# EAGLE schematic isolator_v2 (EAGLE 5.12)

## Sheet 1 of 6
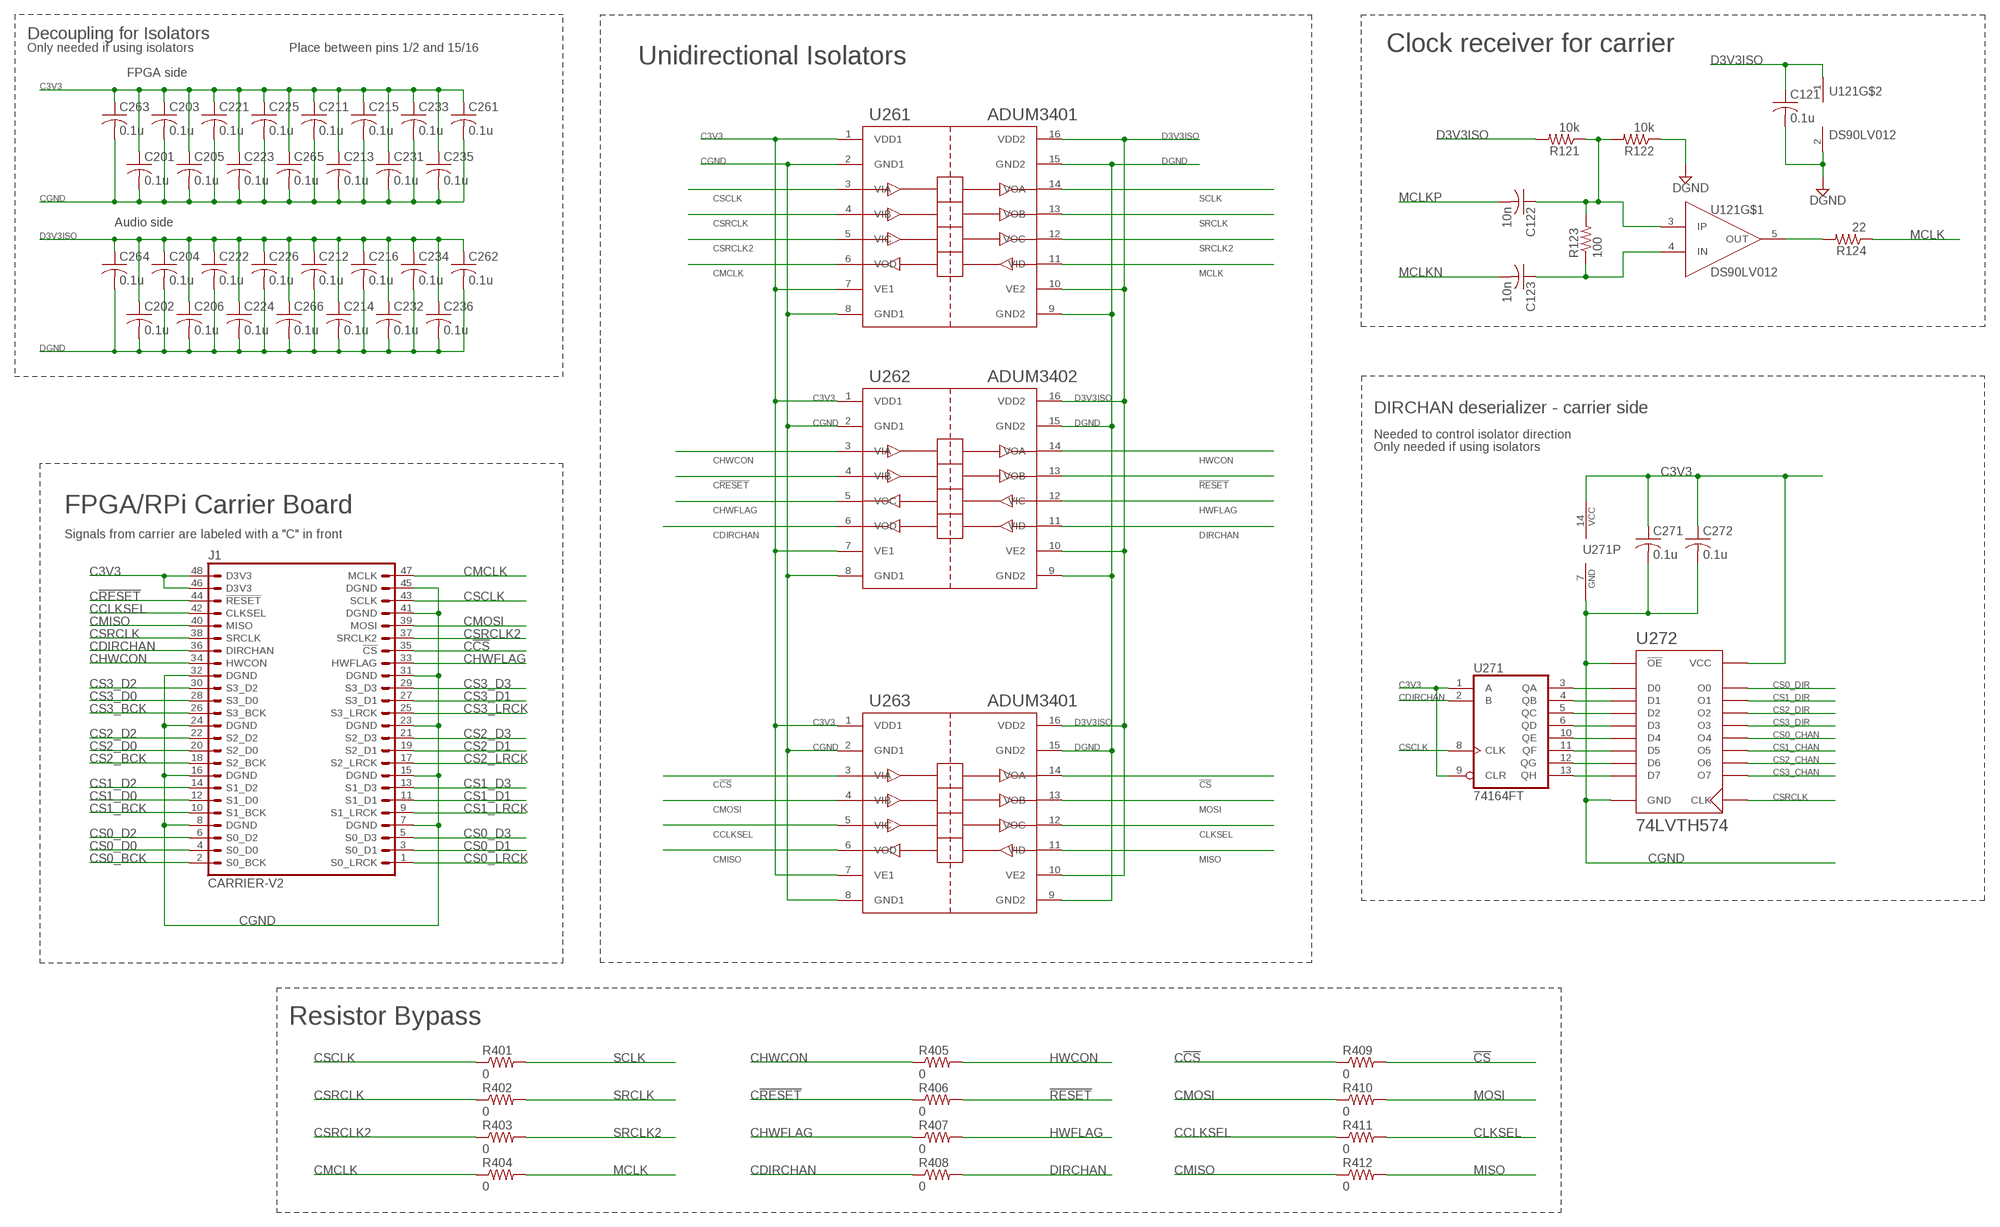
[diagram p0: schematic, sheet 1]

### Parts
C121  0.1u  C-USC0603  [C0603]
C122  10n  C-USC0603  [C0603]
C123  10n  C-USC0603  [C0603]
C201  0.1u  C-USC0603  [C0603]
C202  0.1u  C-USC0603  [C0603]
C203  0.1u  C-USC0603  [C0603]
C204  0.1u  C-USC0603  [C0603]
C205  0.1u  C-USC0603  [C0603]
C206  0.1u  C-USC0603  [C0603]
C211  0.1u  C-USC0603  [C0603]
C212  0.1u  C-USC0603  [C0603]
C213  0.1u  C-USC0603  [C0603]
C214  0.1u  C-USC0603  [C0603]
C215  0.1u  C-USC0603  [C0603]
C216  0.1u  C-USC0603  [C0603]
C221  0.1u  C-USC0603  [C0603]
C222  0.1u  C-USC0603  [C0603]
C223  0.1u  C-USC0603  [C0603]
C224  0.1u  C-USC0603  [C0603]
C225  0.1u  C-USC0603  [C0603]
C226  0.1u  C-USC0603  [C0603]
C231  0.1u  C-USC0603  [C0603]
C232  0.1u  C-USC0603  [C0603]
C233  0.1u  C-USC0603  [C0603]
C234  0.1u  C-USC0603  [C0603]
C235  0.1u  C-USC0603  [C0603]
C236  0.1u  C-USC0603  [C0603]
C261  0.1u  C-USC0603  [C0603]
C262  0.1u  C-USC0603  [C0603]
C263  0.1u  C-USC0603  [C0603]
C264  0.1u  C-USC0603  [C0603]
C265  0.1u  C-USC0603  [C0603]
C266  0.1u  C-USC0603  [C0603]
C271  0.1u  C-USC0603  [C0603]
C272  0.1u  C-USC0603  [C0603]
J1  CARRIER-V2  [MA24-2]
R121  10k  R-US_R0603  [R0603]
R122  10k  R-US_R0603  [R0603]
R123  100  R-US_R0603  [R0603]
R124  22  R-US_R0603  [R0603]
R401  0  R-US_R1206  [R1206]
R402  0  R-US_R1206  [R1206]
R403  0  R-US_R1206  [R1206]
R404  0  R-US_R1206  [R1206]
R405  0  R-US_R1206  [R1206]
R406  0  R-US_R1206  [R1206]
R407  0  R-US_R1206  [R1206]
R408  0  R-US_R1206  [R1206]
R409  0  R-US_R1206  [R1206]
R410  0  R-US_R1206  [R1206]
R411  0  R-US_R1206  [R1206]
R412  0  R-US_R1206  [R1206]
U121  DS90LV012  [SOT23-DBV]
U261  ADUM3401  [SO-16W]
U262  ADUM3402  [SO-16W]
U263  ADUM3401  [SO-16W]
U271  74164FT  [TSSOP14]
U272  74LVTH574  [TSSOP20]

### Nets
!CS: R409.2 U263.14(VOA) ; also sheet 6
!RESET: R406.2 U262.13(VOB) ; also sheet 5
C3V3 [power]: C201.1 C203.1 C205.1 C211.1 C213.1 C215.1 C221.1 C223.1 C225.1 C231.1 C233.1 C235.1 C261.1 C263.1 C265.1 C271.1 C272.1 J1.46(D3V3) J1.48(D3V3) U261.1(VDD1) U261.7(VE1) U262.1(VDD1) U262.7(VE1) U263.1(VDD1) U263.7(VE1) U271.1(A) U271.9(CLR) U271.14(VCC) U272.20(VCC) ; also sheet 2
C!CS: J1.35(!CS) R409.1 U263.3(VIA) ; also sheet 3
C!RESET: J1.44(!RESET) R406.1 U262.4(VIB) ; also sheet 3
CCLKSEL: J1.42(CLKSEL) R411.1 U263.5(VIC) ; also sheet 3
CDIRCHAN: J1.36(DIRCHAN) R408.1 U262.6(VOD) U271.2(B) ; also sheet 3
CGND [power]: C201.2 C203.2 C205.2 C211.2 C213.2 C215.2 C221.2 C223.2 C225.2 C231.2 C233.2 C235.2 C261.2 C263.2 C265.2 C271.2 C272.2 J1.7(DGND) J1.8(DGND) J1.15(DGND) J1.16(DGND) J1.23(DGND) J1.24(DGND) J1.31(DGND) J1.32(DGND) J1.41(DGND) J1.45(DGND) U261.2(GND1) U261.8(GND1) U262.2(GND1) U262.8(GND1) U263.2(GND1) U263.8(GND1) U271.7(GND) U272.1(!OE) U272.10(GND) ; also sheet 2,3
CHWCON: J1.34(HWCON) R405.1 U262.3(VIA) ; also sheet 3
CHWFLAG: J1.33(HWFLAG) R407.1 U262.5(VOC) ; also sheet 3
CLKSEL: R411.2 U263.12(VOC) ; also sheet 6
CMCLK: J1.47(MCLK) R404.1 U261.6(VOD) ; also sheet 3
CMISO: J1.40(MISO) R412.1 U263.6(VOD) ; also sheet 3
CMOSI: J1.39(MOSI) R410.1 U263.4(VIB) ; also sheet 3
CS0_BCK: J1.2(S0_BCK) ; also sheet 2,3
CS0_CHAN: U272.15(O4)
CS0_D0: J1.4(S0_D0) ; also sheet 2,3
CS0_D1: J1.3(S0_D1) ; also sheet 2,3
CS0_D2: J1.6(S0_D2) ; also sheet 2,3
CS0_D3: J1.5(S0_D3) ; also sheet 2,3
CS0_DIR: U272.19(O0) ; also sheet 2
CS0_LRCK: J1.1(S0_LRCK) ; also sheet 2,3
CS1_BCK: J1.10(S1_BCK) ; also sheet 2,3
CS1_CHAN: U272.14(O5)
CS1_D0: J1.12(S1_D0) ; also sheet 2,3
CS1_D1: J1.11(S1_D1) ; also sheet 2,3
CS1_D2: J1.14(S1_D2) ; also sheet 2,3
CS1_D3: J1.13(S1_D3) ; also sheet 2,3
CS1_DIR: U272.18(O1) ; also sheet 2
CS1_LRCK: J1.9(S1_LRCK) ; also sheet 2,3
CS2_BCK: J1.18(S2_BCK) ; also sheet 2,3
CS2_CHAN: U272.13(O6)
CS2_D0: J1.20(S2_D0) ; also sheet 2,3
CS2_D1: J1.19(S2_D1) ; also sheet 2,3
CS2_D2: J1.22(S2_D2) ; also sheet 2,3
CS2_D3: J1.21(S2_D3) ; also sheet 2,3
CS2_DIR: U272.17(O2) ; also sheet 2
CS2_LRCK: J1.17(S2_LRCK) ; also sheet 2,3
CS3_BCK: J1.26(S3_BCK) ; also sheet 2,3
CS3_CHAN: U272.12(O7)
CS3_D0: J1.28(S3_D0) ; also sheet 2,3
CS3_D1: J1.27(S3_D1) ; also sheet 2,3
CS3_D2: J1.30(S3_D2) ; also sheet 2,3
CS3_D3: J1.29(S3_D3) ; also sheet 2,3
CS3_DIR: U272.16(O3) ; also sheet 2
CS3_LRCK: J1.25(S3_LRCK) ; also sheet 2,3
CSCLK: J1.43(SCLK) R401.1 U261.3(VIA) U271.8(CLK) ; also sheet 3
CSRCLK: J1.38(SRCLK) R402.1 U261.4(VIB) U272.11(CLK) ; also sheet 3
CSRCLK2: J1.37(SRCLK2) R403.1 U261.5(VIC) ; also sheet 3
D3V3ISO [power]: C121.1 C202.1 C204.1 C206.1 C212.1 C214.1 C216.1 C222.1 C224.1 C226.1 C232.1 C234.1 C236.1 C262.1 C264.1 C266.1 R121.2 U121.1(V+) U261.10(VE2) U261.16(VDD2) U262.10(VE2) U262.16(VDD2) U263.10(VE2) U263.16(VDD2) ; also sheet 2,6
DGND [power]: C121.2 C202.2 C204.2 C206.2 C212.2 C214.2 C216.2 C222.2 C224.2 C226.2 C232.2 C234.2 C236.2 C262.2 C264.2 C266.2 R122.1 U121.2(V-) U261.9(GND2) U261.15(GND2) U262.9(GND2) U262.15(GND2) U263.9(GND2) U263.15(GND2) ; also sheet 2,3,4,5,6
DIRCHAN: R408.2 U262.11(VID) ; also sheet 6
HWCON: R405.2 U262.14(VOA) ; also sheet 6
HWFLAG: R407.2 U262.12(VIC) ; also sheet 6
MCLK: R124.1 R404.2 U261.11(VID)
MCLKN: C123.2 ; also sheet 6
MCLKP: C122.2 ; also sheet 6
MISO: R412.2 U263.11(VID) ; also sheet 5,6
MOSI: R410.2 U263.13(VOB) ; also sheet 5
N$21: U271.3(QA) U272.2(D0)
N$22: U271.4(QB) U272.3(D1)
N$23: U271.5(QC) U272.4(D2)
N$24: U271.6(QD) U272.5(D3)
N$25: U271.10(QE) U272.6(D4)
N$26: U271.11(QF) U272.7(D5)
N$27: U271.12(QG) U272.8(D6)
N$28: U271.13(QH) U272.9(D7)
N$30: C123.1 R123.1 U121.4(IN)
N$31: C122.1 R121.1 R122.2 R123.2 U121.3(IP)
N$32: R124.2 U121.5(OUT)
SCLK: R401.2 U261.14(VOA) ; also sheet 5,6
SRCLK: R402.2 U261.13(VOB) ; also sheet 5,6
SRCLK2: R403.2 U261.12(VOC) ; also sheet 5

### Notes on the sheet
- Decoupling for Isolators
- Only needed if using isolators | Place between pins 1/2 and 15/16 | Clock receiver for carrier
- Unidirectional Isolators
- FPGA side
- Audio side
- DIRCHAN deserializer - carrier side
- Needed to control isolator direction
- Only needed if using isolators
- FPGA/RPi Carrier Board
- Signals from carrier are labeled with a "C" in front
- Resistor Bypass

## Sheet 2 of 6
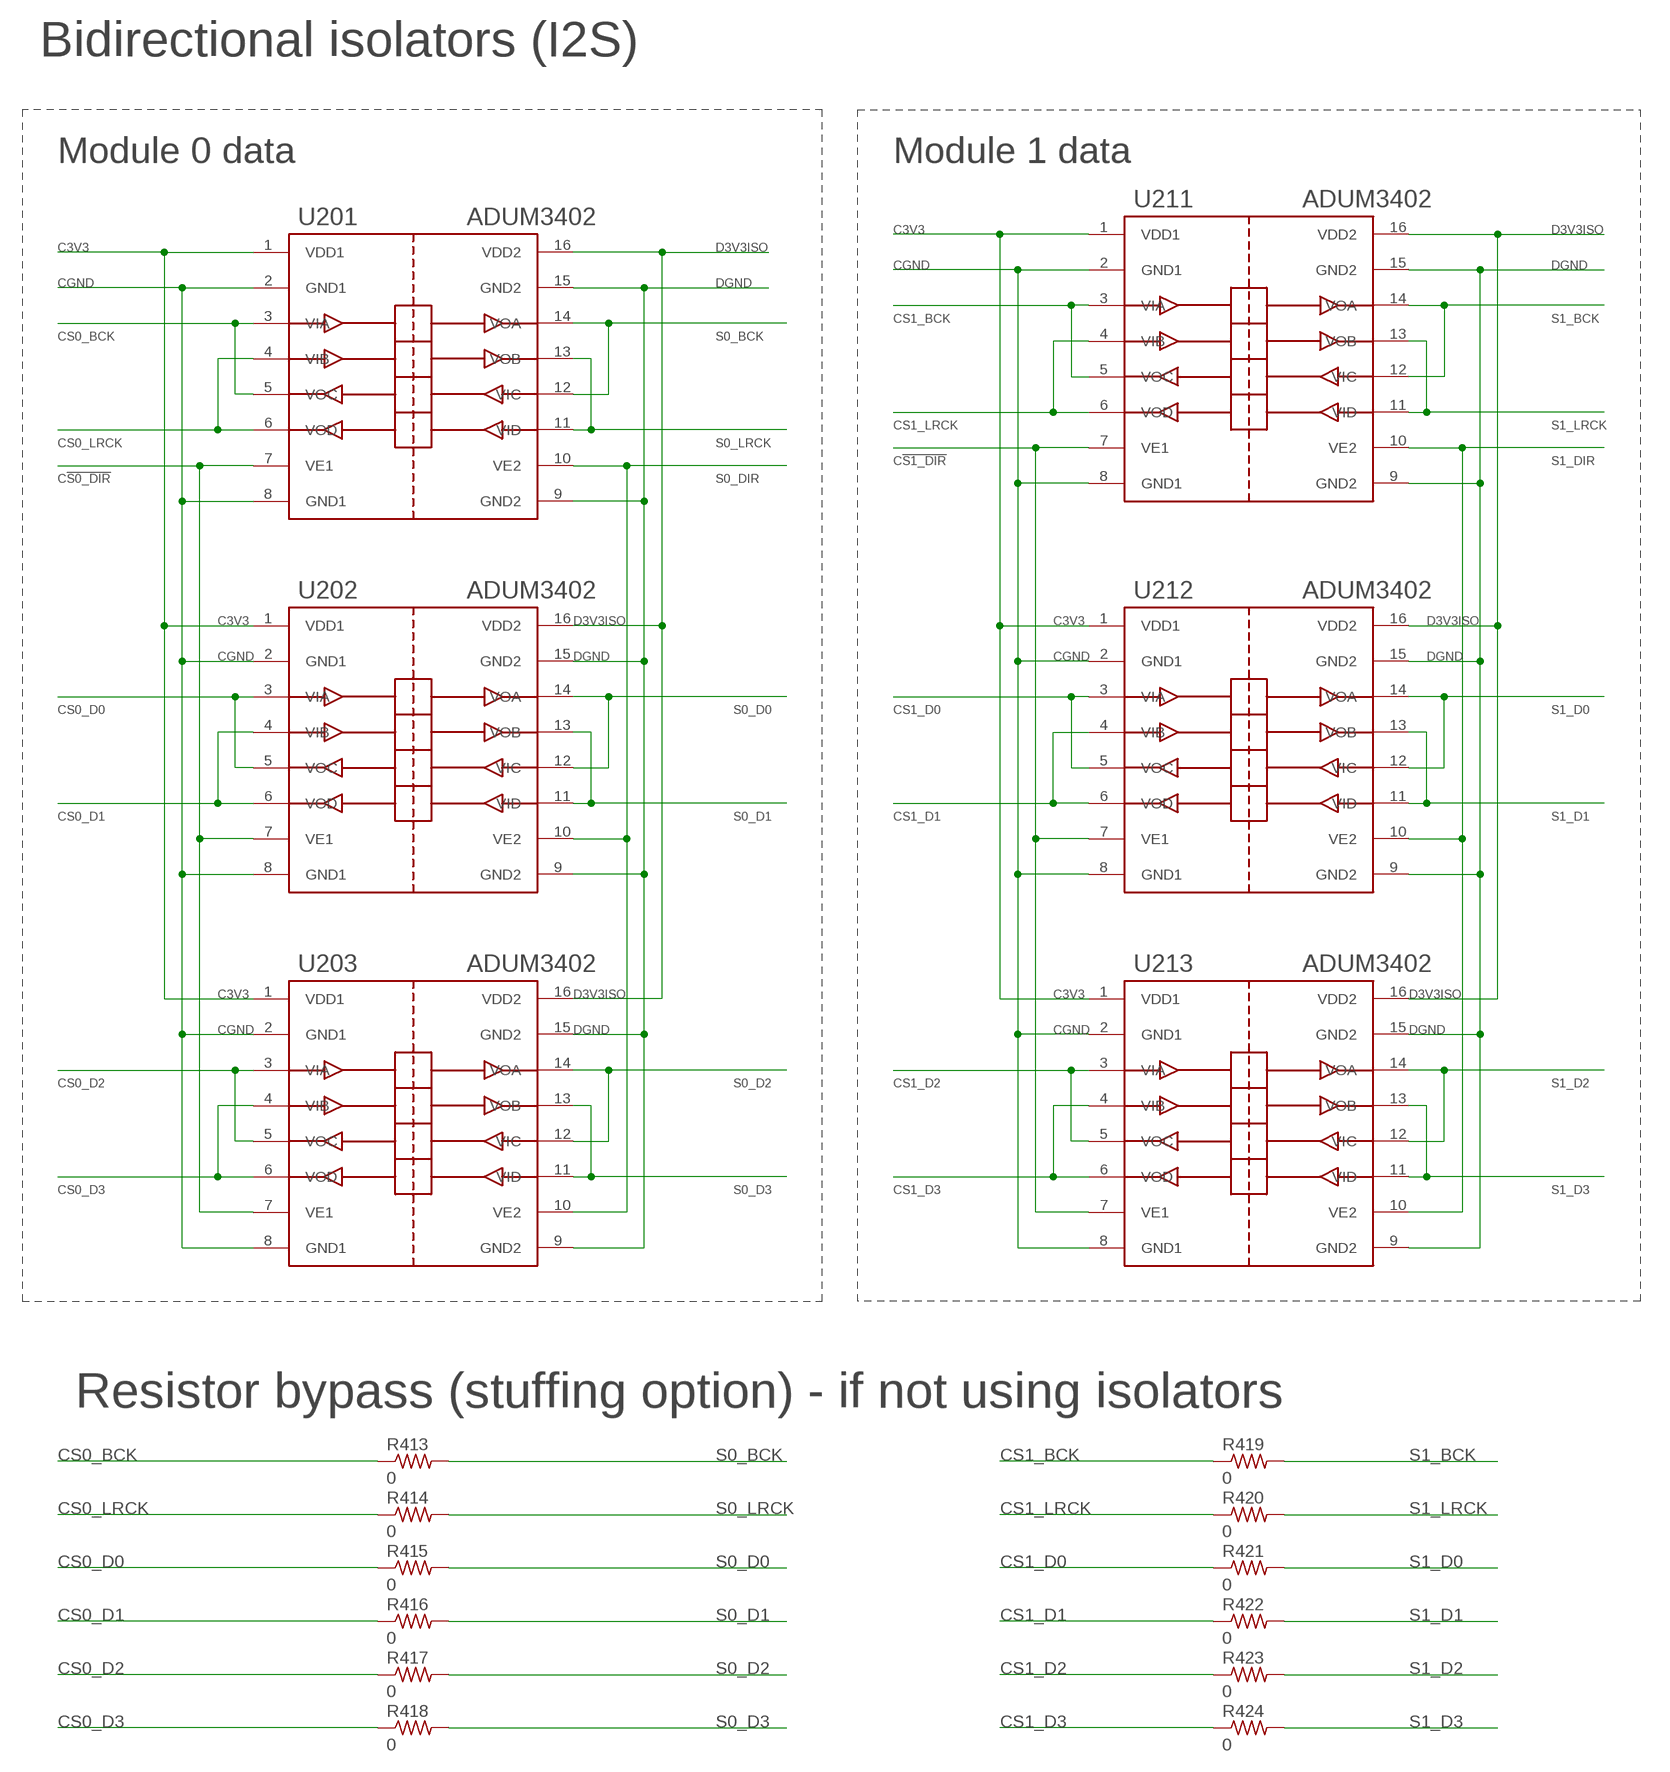
[diagram p1: schematic, sheet 2, part 1 of 2]
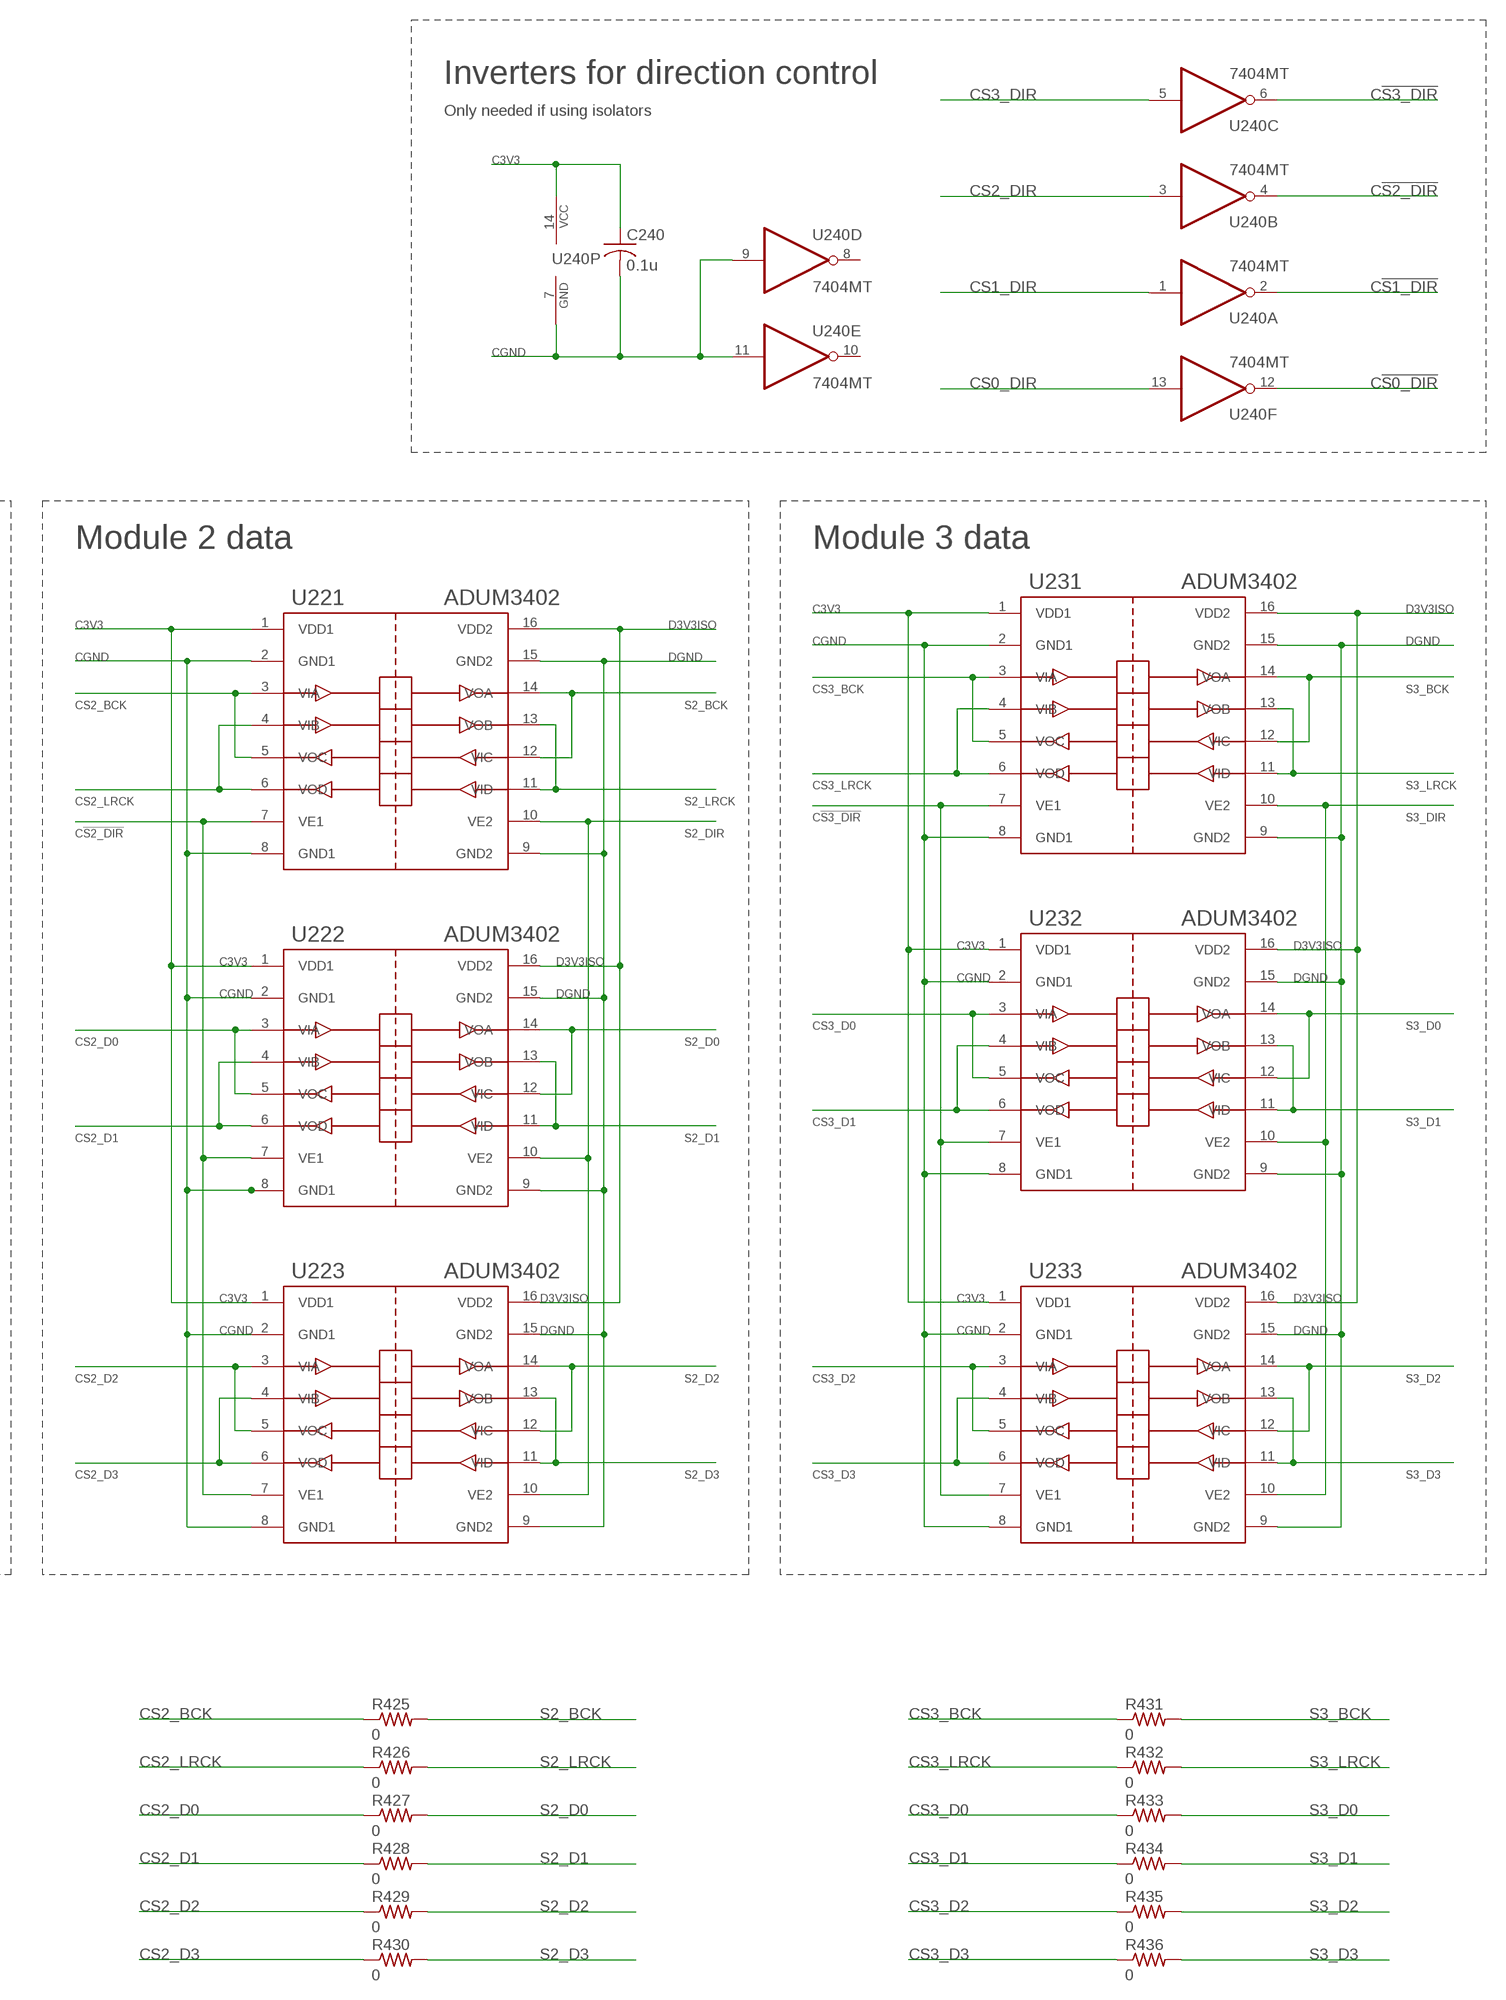
[diagram p2: schematic, sheet 2, part 2 of 2]

### Parts
C240  0.1u  C-USC0603  [C0603]
R413  0  R-US_R1206  [R1206]
R414  0  R-US_R1206  [R1206]
R415  0  R-US_R1206  [R1206]
R416  0  R-US_R1206  [R1206]
R417  0  R-US_R1206  [R1206]
R418  0  R-US_R1206  [R1206]
R419  0  R-US_R1206  [R1206]
R420  0  R-US_R1206  [R1206]
R421  0  R-US_R1206  [R1206]
R422  0  R-US_R1206  [R1206]
R423  0  R-US_R1206  [R1206]
R424  0  R-US_R1206  [R1206]
R425  0  R-US_R1206  [R1206]
R426  0  R-US_R1206  [R1206]
R427  0  R-US_R1206  [R1206]
R428  0  R-US_R1206  [R1206]
R429  0  R-US_R1206  [R1206]
R430  0  R-US_R1206  [R1206]
R431  0  R-US_R1206  [R1206]
R432  0  R-US_R1206  [R1206]
R433  0  R-US_R1206  [R1206]
R434  0  R-US_R1206  [R1206]
R435  0  R-US_R1206  [R1206]
R436  0  R-US_R1206  [R1206]
U201  ADUM3402  [SO-16W]
U202  ADUM3402  [SO-16W]
U203  ADUM3402  [SO-16W]
U211  ADUM3402  [SO-16W]
U212  ADUM3402  [SO-16W]
U213  ADUM3402  [SO-16W]
U221  ADUM3402  [SO-16W]
U222  ADUM3402  [SO-16W]
U223  ADUM3402  [SO-16W]
U231  ADUM3402  [SO-16W]
U232  ADUM3402  [SO-16W]
U233  ADUM3402  [SO-16W]
U240  7404MT  [TSSOP14]

### Nets
C3V3 [power]: C240.1 U201.1(VDD1) U202.1(VDD1) U203.1(VDD1) U211.1(VDD1) U212.1(VDD1) U213.1(VDD1) U221.1(VDD1) U222.1(VDD1) U223.1(VDD1) U231.1(VDD1) U232.1(VDD1) U233.1(VDD1) U240.14(P:VCC) ; also sheet 1
C!S0_DIR: U201.7(VE1) U202.7(VE1) U203.7(VE1) U240.12(F:O) ; also sheet 3
C!S1_DIR: U211.7(VE1) U212.7(VE1) U213.7(VE1) U240.2(A:O) ; also sheet 3
C!S2_DIR: U221.7(VE1) U222.7(VE1) U223.7(VE1) U240.4(B:O) ; also sheet 3
C!S3_DIR: U231.7(VE1) U232.7(VE1) U233.7(VE1) U240.6(C:O) ; also sheet 3
CGND [power]: C240.2 U201.2(GND1) U201.8(GND1) U202.2(GND1) U202.8(GND1) U203.2(GND1) U203.8(GND1) U211.2(GND1) U211.8(GND1) U212.2(GND1) U212.8(GND1) U213.2(GND1) U213.8(GND1) U221.2(GND1) U221.8(GND1) U222.2(GND1) U222.8(GND1) U223.2(GND1) U223.8(GND1) U231.2(GND1) U231.8(GND1) U232.2(GND1) U232.8(GND1) U233.2(GND1) U233.8(GND1) U240.7(P:GND) U240.9(D:I) U240.11(E:I) ; also sheet 1,3
CS0_BCK: R413.1 U201.3(VIA) U201.5(VOC) ; also sheet 1,3
CS0_D0: R415.1 U202.3(VIA) U202.5(VOC) ; also sheet 1,3
CS0_D1: R416.1 U202.4(VIB) U202.6(VOD) ; also sheet 1,3
CS0_D2: R417.1 U203.3(VIA) U203.5(VOC) ; also sheet 1,3
CS0_D3: R418.1 U203.4(VIB) U203.6(VOD) ; also sheet 1,3
CS0_DIR: U240.13(F:I) ; also sheet 1
CS0_LRCK: R414.1 U201.4(VIB) U201.6(VOD) ; also sheet 1,3
CS1_BCK: R419.1 U211.3(VIA) U211.5(VOC) ; also sheet 1,3
CS1_D0: R421.1 U212.3(VIA) U212.5(VOC) ; also sheet 1,3
CS1_D1: R422.1 U212.4(VIB) U212.6(VOD) ; also sheet 1,3
CS1_D2: R423.1 U213.3(VIA) U213.5(VOC) ; also sheet 1,3
CS1_D3: R424.1 U213.4(VIB) U213.6(VOD) ; also sheet 1,3
CS1_DIR: U240.1(A:I) ; also sheet 1
CS1_LRCK: R420.1 U211.4(VIB) U211.6(VOD) ; also sheet 1,3
CS2_BCK: R425.1 U221.3(VIA) U221.5(VOC) ; also sheet 1,3
CS2_D0: R427.1 U222.3(VIA) U222.5(VOC) ; also sheet 1,3
CS2_D1: R428.1 U222.4(VIB) U222.6(VOD) ; also sheet 1,3
CS2_D2: R429.1 U223.3(VIA) U223.5(VOC) ; also sheet 1,3
CS2_D3: R430.1 U223.4(VIB) U223.6(VOD) ; also sheet 1,3
CS2_DIR: U240.3(B:I) ; also sheet 1
CS2_LRCK: R426.1 U221.4(VIB) U221.6(VOD) ; also sheet 1,3
CS3_BCK: R431.1 U231.3(VIA) U231.5(VOC) ; also sheet 1,3
CS3_D0: R433.1 U232.3(VIA) U232.5(VOC) ; also sheet 1,3
CS3_D1: R434.1 U232.4(VIB) U232.6(VOD) ; also sheet 1,3
CS3_D2: R435.1 U233.3(VIA) U233.5(VOC) ; also sheet 1,3
CS3_D3: R436.1 U233.4(VIB) U233.6(VOD) ; also sheet 1,3
CS3_DIR: U240.5(C:I) ; also sheet 1
CS3_LRCK: R432.1 U231.4(VIB) U231.6(VOD) ; also sheet 1,3
D3V3ISO [power]: U201.16(VDD2) U202.16(VDD2) U203.16(VDD2) U211.16(VDD2) U212.16(VDD2) U213.16(VDD2) U221.16(VDD2) U222.16(VDD2) U223.16(VDD2) U231.16(VDD2) U232.16(VDD2) U233.16(VDD2) ; also sheet 1,6
DGND [power]: U201.9(GND2) U201.15(GND2) U202.9(GND2) U202.15(GND2) U203.9(GND2) U203.15(GND2) U211.9(GND2) U211.15(GND2) U212.9(GND2) U212.15(GND2) U213.9(GND2) U213.15(GND2) U221.9(GND2) U221.15(GND2) U222.9(GND2) U222.15(GND2) U223.9(GND2) U223.15(GND2) U231.9(GND2) U231.15(GND2) U232.9(GND2) U232.15(GND2) U233.9(GND2) U233.15(GND2) ; also sheet 1,3,4,5,6
S0_BCK: R413.2 U201.12(VIC) U201.14(VOA) ; also sheet 5
S0_D0: R415.2 U202.12(VIC) U202.14(VOA) ; also sheet 5
S0_D1: R416.2 U202.11(VID) U202.13(VOB) ; also sheet 5
S0_D2: R417.2 U203.12(VIC) U203.14(VOA) ; also sheet 5
S0_D3: R418.2 U203.11(VID) U203.13(VOB) ; also sheet 5
S0_DIR: U201.10(VE2) U202.10(VE2) U203.10(VE2) ; also sheet 5,6
S0_LRCK: R414.2 U201.11(VID) U201.13(VOB) ; also sheet 5
S1_BCK: R419.2 U211.12(VIC) U211.14(VOA) ; also sheet 5
S1_D0: R421.2 U212.12(VIC) U212.14(VOA) ; also sheet 5
S1_D1: R422.2 U212.11(VID) U212.13(VOB) ; also sheet 5
S1_D2: R423.2 U213.12(VIC) U213.14(VOA) ; also sheet 5
S1_D3: R424.2 U213.11(VID) U213.13(VOB) ; also sheet 5
S1_DIR: U211.10(VE2) U212.10(VE2) U213.10(VE2) ; also sheet 5,6
S1_LRCK: R420.2 U211.11(VID) U211.13(VOB) ; also sheet 5
S2_BCK: R425.2 U221.12(VIC) U221.14(VOA) ; also sheet 5
S2_D0: R427.2 U222.12(VIC) U222.14(VOA) ; also sheet 5
S2_D1: R428.2 U222.11(VID) U222.13(VOB) ; also sheet 5
S2_D2: R429.2 U223.12(VIC) U223.14(VOA) ; also sheet 5
S2_D3: R430.2 U223.11(VID) U223.13(VOB) ; also sheet 5
S2_DIR: U221.10(VE2) U222.10(VE2) U223.10(VE2) ; also sheet 5,6
S2_LRCK: R426.2 U221.11(VID) U221.13(VOB) ; also sheet 5
S3_BCK: R431.2 U231.12(VIC) U231.14(VOA) ; also sheet 5
S3_D0: R433.2 U232.12(VIC) U232.14(VOA) ; also sheet 5
S3_D1: R434.2 U232.11(VID) U232.13(VOB) ; also sheet 5
S3_D2: R435.2 U233.12(VIC) U233.14(VOA) ; also sheet 5
S3_D3: R436.2 U233.11(VID) U233.13(VOB) ; also sheet 5
S3_DIR: U231.10(VE2) U232.10(VE2) U233.10(VE2) ; also sheet 5,6
S3_LRCK: R432.2 U231.11(VID) U231.13(VOB) ; also sheet 5
Unconnected: U240.8(D:O) U240.10(E:O)

### Notes on the sheet
- Inverters for direction control
- Only needed if using isolators
- Bidirectional isolators (I2S)
- Module 0 data | Module 1 data | Module 2 data | Module 3 data
- Resistor bypass (stuffing option) - if not using isolators

## Sheet 3 of 6
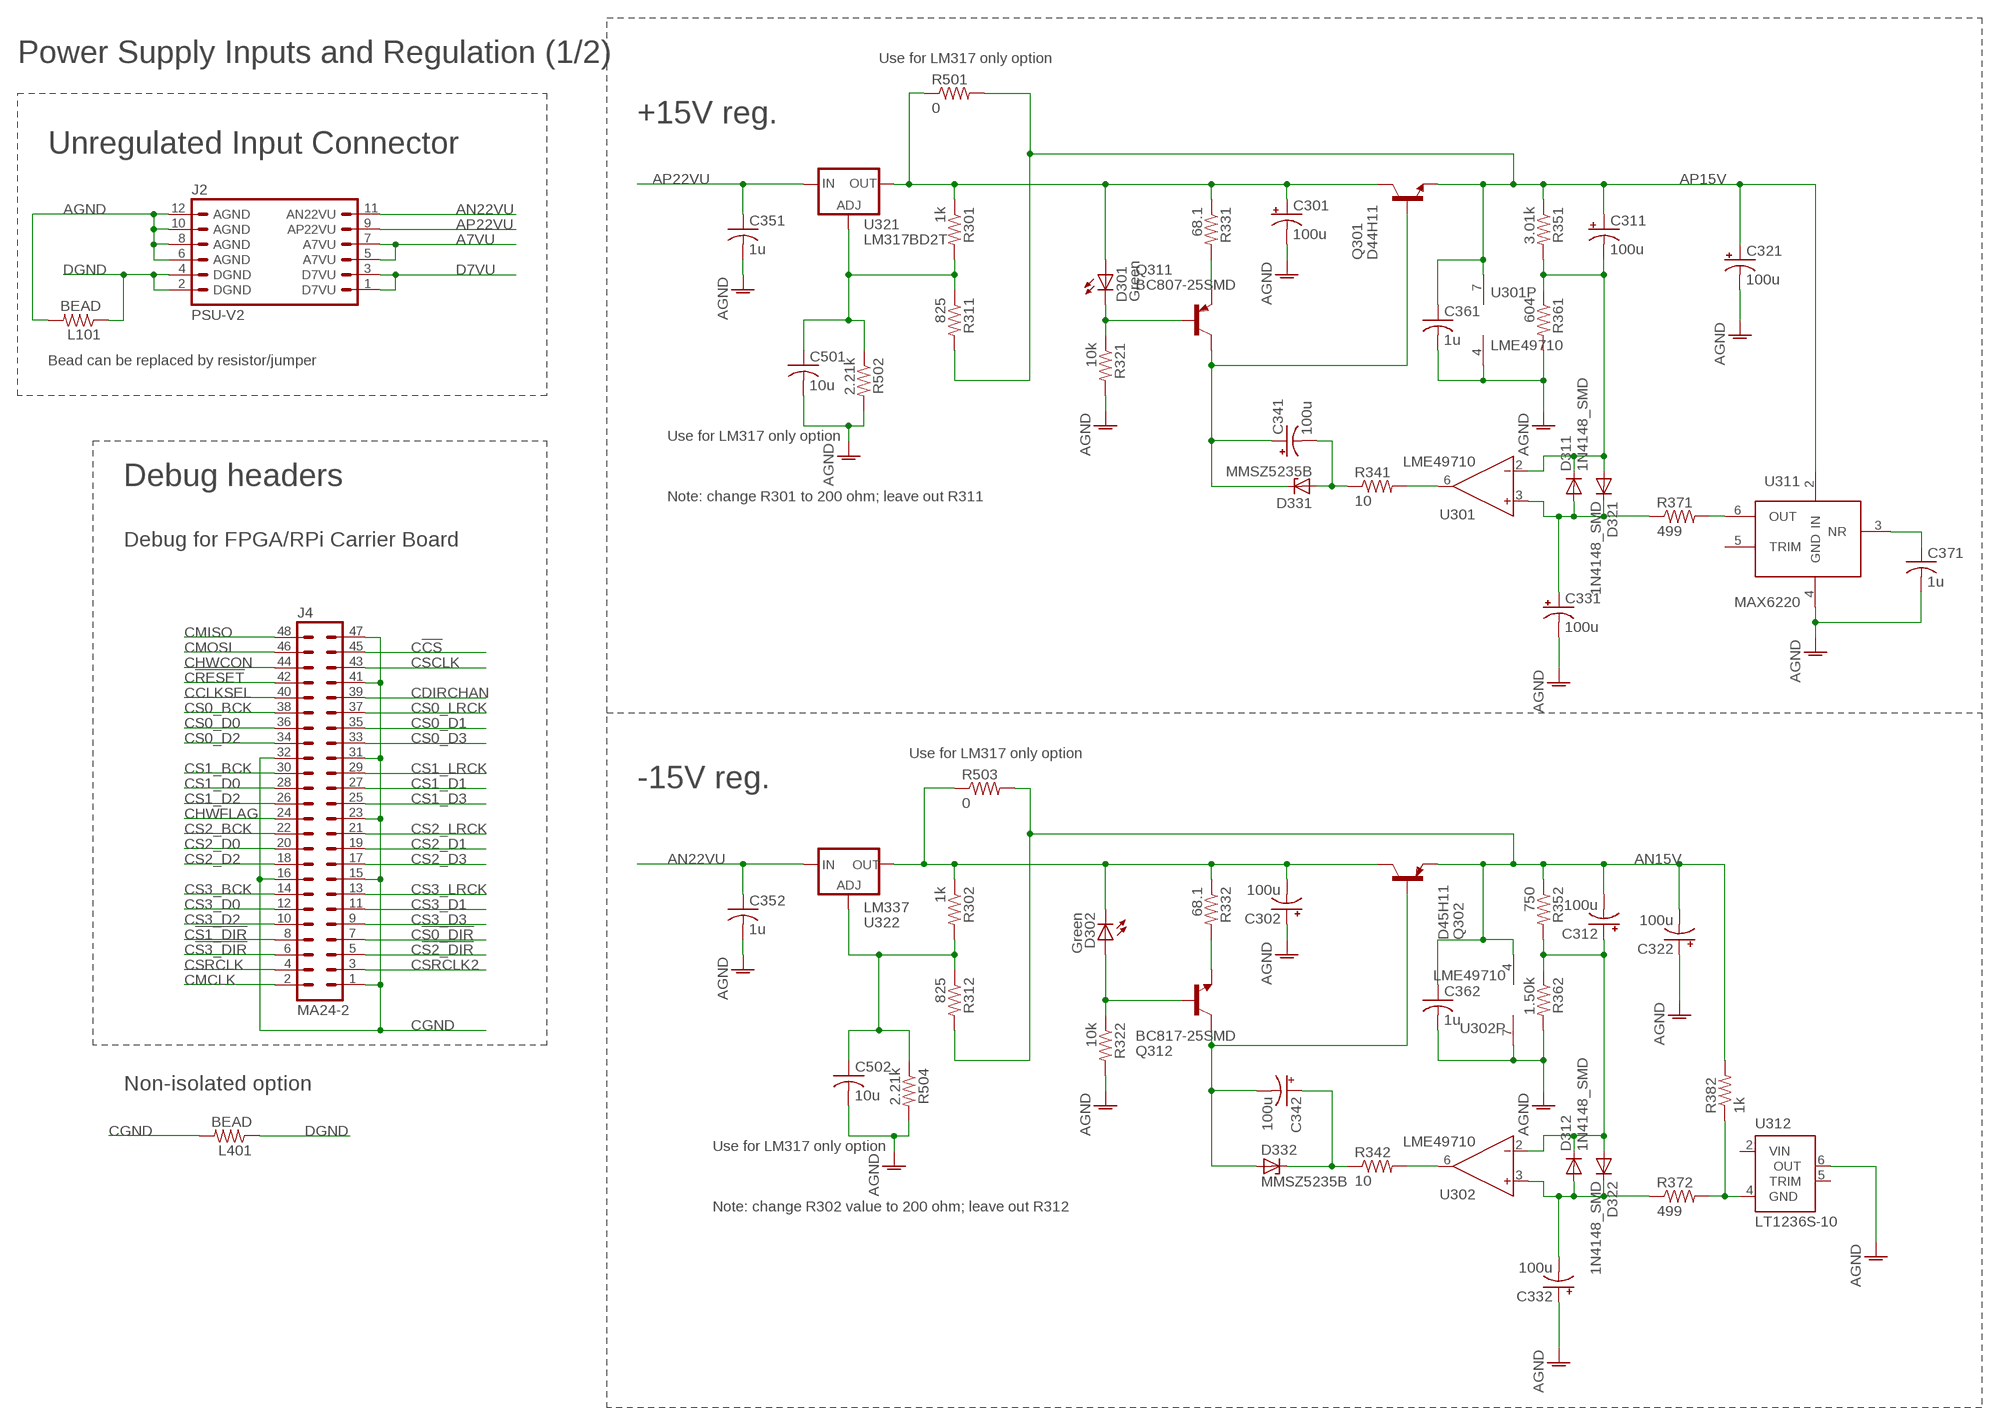
[diagram p3: schematic, sheet 3]

### Parts
C301  100u  CPOL-USF  [PANASONIC_F]
C302  100u  CPOL-USF  [PANASONIC_F]
C311  100u  CPOL-USF  [PANASONIC_F]
C312  100u  CPOL-USF  [PANASONIC_F]
C321  100u  CPOL-USF  [PANASONIC_F]
C322  100u  CPOL-USF  [PANASONIC_F]
C331  100u  CPOL-USF  [PANASONIC_F]
C332  100u  CPOL-USF  [PANASONIC_F]
C341  100u  CPOL-USF  [PANASONIC_F]
C342  100u  CPOL-USF  [PANASONIC_F]
C351  1u  C-USC1206  [C1206]
C352  1u  C-USC1206  [C1206]
C361  1u  C-USC1206  [C1206]
C362  1u  C-USC1206  [C1206]
C371  1u  C-USC1206  [C1206]
C501  10u  C-USC1206  [C1206]
C502  10u  C-USC1206  [C1206]
D301  Green  LEDCHIPLED_1206  [CHIPLED_1206]
D302  Green  LEDCHIPLED_1206  [CHIPLED_1206]
D311  1N4148_SMD  [SOD123]
D312  1N4148_SMD  [SOD123]
D321  1N4148_SMD  [SOD123]
D322  1N4148_SMD  [SOD123]
D331  MMSZ5235B  ZD  [SOD123]
D332  MMSZ5235B  ZD  [SOD123]
J2  PSU-V2  [MA06-2]
J4  MA24-2  [MA24-2-HEADERONLY]
L101  BEAD  R-US_R1206  [R1206]
L401  BEAD  R-US_R1206  [R1206]
Q301  D44H11  [D2PACK]
Q302  D45H11  [D2PACK]
Q311  BC807-25SMD  [SOT23-BEC]
Q312  BC817-25SMD  [SOT23-BEC]
R301  1k  R-US_R0603  [R0603]
R302  1k  R-US_R0603  [R0603]
R311  825  R-US_R0603  [R0603]
R312  825  R-US_R0603  [R0603]
R321  10k  R-US_R1206  [R1206]
R322  10k  R-US_R1206  [R1206]
R331  68.1  R-US_R1206  [R1206]
R332  68.1  R-US_R1206  [R1206]
R341  10  R-US_R1206  [R1206]
R342  10  R-US_R1206  [R1206]
R351  3.01k  R-US_R1206  [R1206]
R352  750  R-US_R1206  [R1206]
R361  604  R-US_R1206  [R1206]
R362  1.50k  R-US_R1206  [R1206]
R371  499  R-US_R0603  [R0603]
R372  499  R-US_R0603  [R0603]
R382  1k  R-US_R0603  [R0603]
R501  0  R-US_R1206  [R1206]
R502  2.21k  R-US_R0603  [R0603]
R503  0  R-US_R1206  [R1206]
R504  2.21k  R-US_R0603  [R0603]
U301  LME49710  AD811_SO8  [SO8]
U302  LME49710  AD811_SO8  [SO8]
U311  MAX6220  [SO8]
U312  LT1236S-10  [SOIC8]
U321  LM317BD2T  [D2PACK]
U322  LM337  LM337LD2  [D2PACK]

### Nets
A7VU [power]: J2.5(A7VU) J2.7(A7VU) ; also sheet 4,5
AGND [power]: C301.- C302.+ C321.- C322.+ C331.- C332.+ C351.2 C352.2 C361.2 C362.2 C371.2 C501.2 C502.2 J2.6(AGND) J2.8(AGND) J2.10(AGND) J2.12(AGND) L101.2 R321.2 R322.2 R361.2 R362.2 R502.2 R504.2 U301.4(V-) U302.7(V+) U311.4(GND) U312.6(OUT) ; also sheet 4,5
AN15V: C312.- C322.- C362.1 Q302.3(E) R312.2 R352.1 R382.2 R503.2 U302.4(V-) ; also sheet 5
AN22VU [power]: C352.1 J2.11(AN22VU) U322.2(IN) ; also sheet 5
AP15V: C311.+ C321.+ C361.1 Q301.3(E) R311.2 R351.1 R501.2 U301.7(V+) U311.2(IN) ; also sheet 5
AP22VU [power]: C351.1 J2.9(AP22VU) U321.3(IN) ; also sheet 5
BASE: C341.+ D331.C Q301.1(B) Q311.C
BASE2: C342.- D332.A Q302.1(B) Q312.C
C!CS: J4.45 ; also sheet 1
C!RESET: J4.42 ; also sheet 1
C!S0_DIR: J4.7 ; also sheet 2
C!S1_DIR: J4.8 ; also sheet 2
C!S2_DIR: J4.5 ; also sheet 2
C!S3_DIR: J4.6 ; also sheet 2
CCLKSEL: J4.40 ; also sheet 1
CDIRCHAN: J4.39 ; also sheet 1
CGND [power]: J4.1 J4.15 J4.16 J4.23 J4.31 J4.32 J4.41 J4.47 L401.2 ; also sheet 1,2
CHWCON: J4.44 ; also sheet 1
CHWFLAG: J4.24 ; also sheet 1
CMCLK: J4.2 ; also sheet 1
CMISO: J4.48 ; also sheet 1
CMOSI: J4.46 ; also sheet 1
CS0_BCK: J4.38 ; also sheet 1,2
CS0_D0: J4.36 ; also sheet 1,2
CS0_D1: J4.35 ; also sheet 1,2
CS0_D2: J4.34 ; also sheet 1,2
CS0_D3: J4.33 ; also sheet 1,2
CS0_LRCK: J4.37 ; also sheet 1,2
CS1_BCK: J4.30 ; also sheet 1,2
CS1_D0: J4.28 ; also sheet 1,2
CS1_D1: J4.27 ; also sheet 1,2
CS1_D2: J4.26 ; also sheet 1,2
CS1_D3: J4.25 ; also sheet 1,2
CS1_LRCK: J4.29 ; also sheet 1,2
CS2_BCK: J4.22 ; also sheet 1,2
CS2_D0: J4.20 ; also sheet 1,2
CS2_D1: J4.19 ; also sheet 1,2
CS2_D2: J4.18 ; also sheet 1,2
CS2_D3: J4.17 ; also sheet 1,2
CS2_LRCK: J4.21 ; also sheet 1,2
CS3_BCK: J4.14 ; also sheet 1,2
CS3_D0: J4.12 ; also sheet 1,2
CS3_D1: J4.11 ; also sheet 1,2
CS3_D2: J4.10 ; also sheet 1,2
CS3_D3: J4.9 ; also sheet 1,2
CS3_LRCK: J4.13 ; also sheet 1,2
CSCLK: J4.43 ; also sheet 1
CSRCLK: J4.4 ; also sheet 1
CSRCLK2: J4.3 ; also sheet 1
D7VU [power]: J2.1(D7VU) J2.3(D7VU) ; also sheet 4,5,6
DGND [power]: J2.2(DGND) J2.4(DGND) L101.1 L401.1 ; also sheet 1,2,4,5,6
N$1: C501.1 R301.2 R311.1 R502.1 U321.1(ADJ)
N$2: C311.- D311.C D321.A R351.2 R361.1 U301.2(IN-)
N$11: R371.2 U311.6(OUT)
N$33: C331.+ D311.A D321.C R371.1 U301.3(IN+)
N$34: R341.2 U301.6(OUT)
N$35: D301.C Q311.B R321.1
N$36: Q311.E R331.2
N$37: C341.- D331.A R341.1
N$38: C301.+ D301.A Q301.2(C) R301.1 R331.1 R501.1 U321.2(OUT)
N$51: C312.+ D312.C D322.A R352.2 R362.1 U302.2(IN-)
N$52: C371.1 U311.3(NR)
N$53: R372.2 R382.1 U312.4(GND)
N$54: C332.- D312.A D322.C R372.1 U302.3(IN+)
N$55: R342.2 U302.6(OUT)
N$56: D302.A Q312.B R322.1
N$57: Q312.E R332.2
N$58: C342.+ D332.C R342.1
N$61: C302.- D302.C Q302.2(C) R302.1 R332.1 R503.1 U322.3(OUT)
N$71: C502.1 R302.2 R312.1 R504.1 U322.1(ADJ)
Unconnected: U301.1(NC) U301.5(NC) U301.8(NC) U302.1(NC) U302.5(NC) U302.8(NC) U311.5(TRIM) U312.2(VIN) U312.5(TRIM)

### Notes on the sheet
- Power Supply Inputs and Regulation (1/2) | Use for LM317 only option
- +15V reg.
- Unregulated Input Connector
- Bead can be replaced by resistor/jumper
- Use for LM317 only option
- Debug headers
- Note: change R301 to 200 ohm; leave out R311
- Debug for FPGA/RPi Carrier Board
- Use for LM317 only option
- -15V reg.
- Non-isolated option
- Use for LM317 only option
- Note: change R302 value to 200 ohm; leave out R312

## Sheet 4 of 6
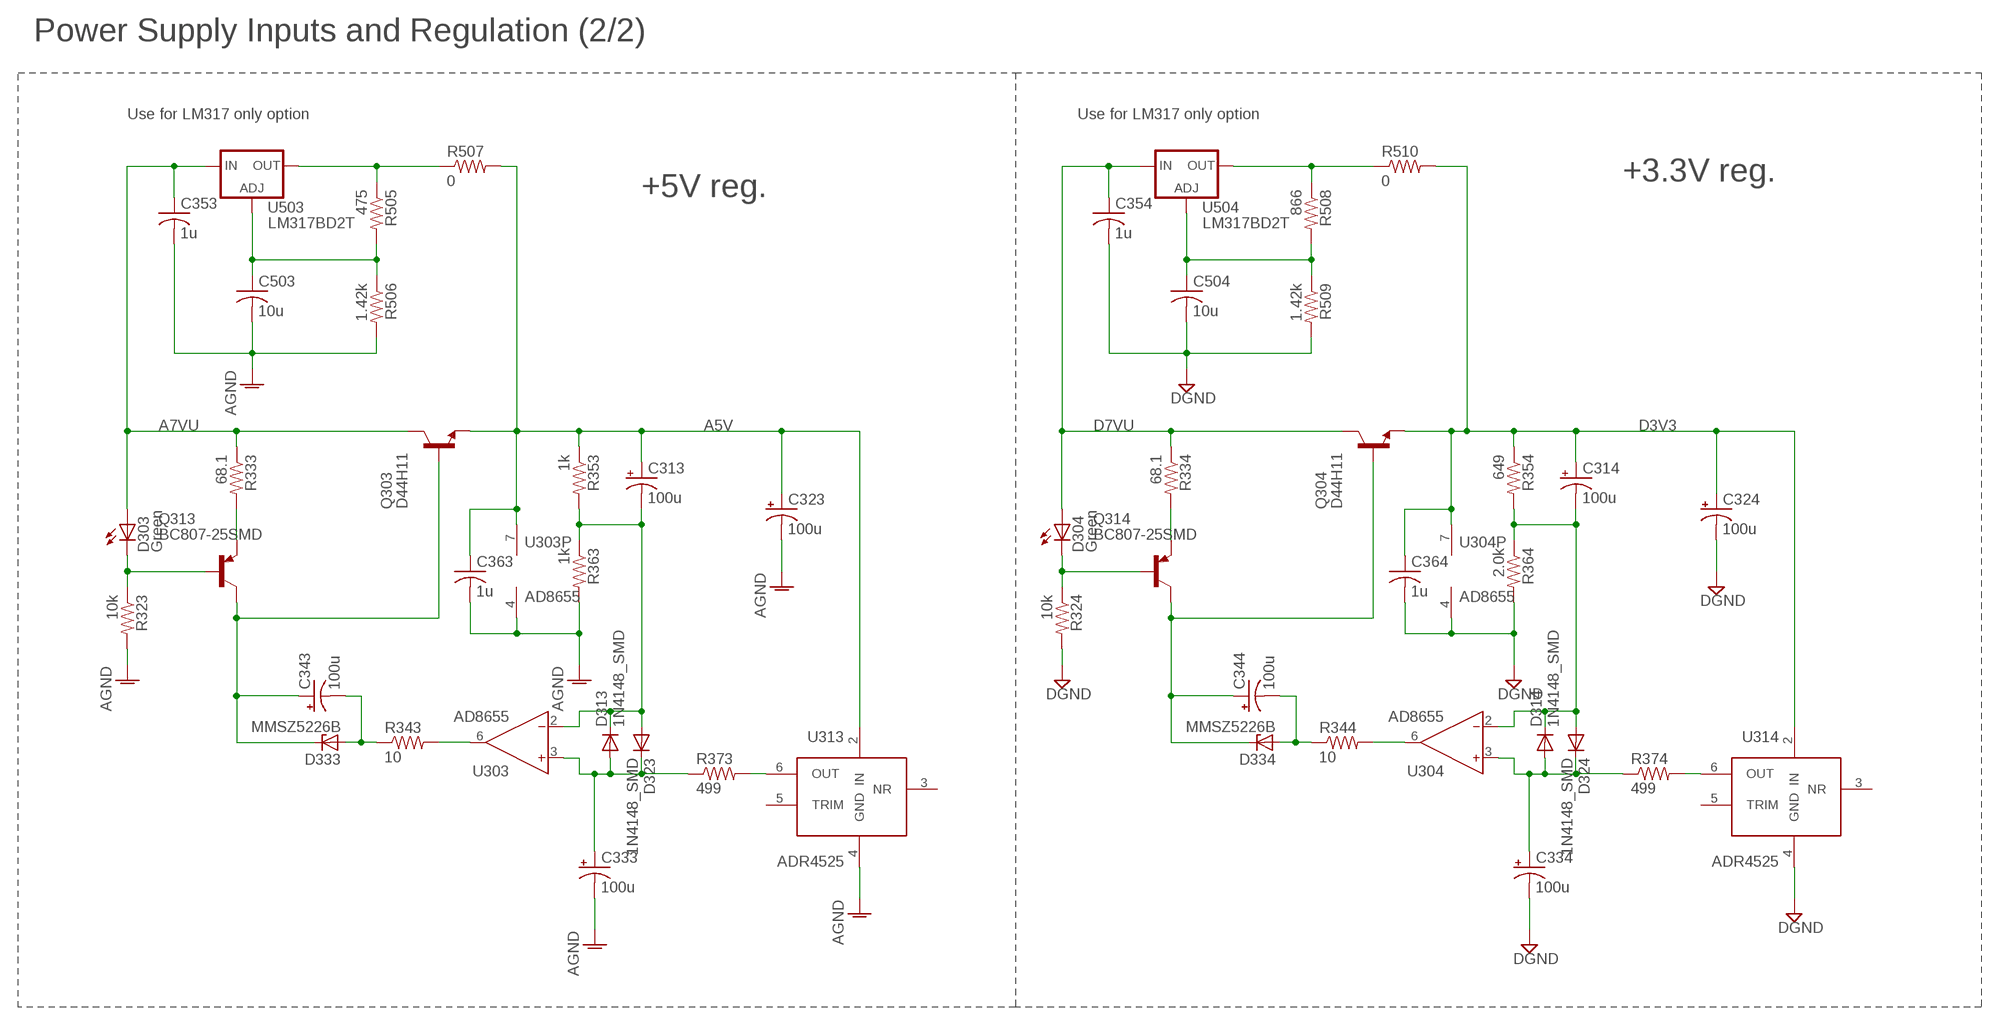
[diagram p4: schematic, sheet 4]

### Parts
C313  100u  CPOL-USF  [PANASONIC_F]
C314  100u  CPOL-USF  [PANASONIC_F]
C323  100u  CPOL-USF  [PANASONIC_F]
C324  100u  CPOL-USF  [PANASONIC_F]
C333  100u  CPOL-USF  [PANASONIC_F]
C334  100u  CPOL-USF  [PANASONIC_F]
C343  100u  CPOL-USF  [PANASONIC_F]
C344  100u  CPOL-USF  [PANASONIC_F]
C353  1u  C-USC1206  [C1206]
C354  1u  C-USC1206  [C1206]
C363  1u  C-USC1206  [C1206]
C364  1u  C-USC1206  [C1206]
C503  10u  C-USC1206  [C1206]
C504  10u  C-USC1206  [C1206]
D303  Green  LEDCHIPLED_1206  [CHIPLED_1206]
D304  Green  LEDCHIPLED_1206  [CHIPLED_1206]
D313  1N4148_SMD  [SOD123]
D314  1N4148_SMD  [SOD123]
D323  1N4148_SMD  [SOD123]
D324  1N4148_SMD  [SOD123]
D333  MMSZ5226B  ZD  [SOD123]
D334  MMSZ5226B  ZD  [SOD123]
Q303  D44H11  [D2PACK]
Q304  D44H11  [D2PACK]
Q313  BC807-25SMD  [SOT23-BEC]
Q314  BC807-25SMD  [SOT23-BEC]
R323  10k  R-US_R1206  [R1206]
R324  10k  R-US_R1206  [R1206]
R333  68.1  R-US_R1206  [R1206]
R334  68.1  R-US_R1206  [R1206]
R343  10  R-US_R1206  [R1206]
R344  10  R-US_R1206  [R1206]
R353  1k  R-US_R1206  [R1206]
R354  649  R-US_R1206  [R1206]
R363  1k  R-US_R1206  [R1206]
R364  2.0k  R-US_R1206  [R1206]
R373  499  R-US_R0603  [R0603]
R374  499  R-US_R0603  [R0603]
R505  475  R-US_R1206  [R1206]
R506  1.42k  R-US_R0603  [R0603]
R507  0  R-US_R1206  [R1206]
R508  866  R-US_R1206  [R1206]
R509  1.42k  R-US_R0603  [R0603]
R510  0  R-US_R1206  [R1206]
U303  AD8655  AD811_SO8  [SO8]
U304  AD8655  AD811_SO8  [SO8]
U313  ADR4525  MAX6220  [SO8]
U314  ADR4525  MAX6220  [SO8]
U503  LM317BD2T  [D2PACK]
U504  LM317BD2T  [D2PACK]

### Nets
A5V: C313.+ C323.+ C363.1 Q303.3(E) R353.1 R507.2 U303.7(V+) U313.2(IN) ; also sheet 5
A7VU [power]: C353.1 D303.A Q303.2(C) R333.1 U503.3(IN) ; also sheet 3,5
AGND [power]: C323.- C333.- C353.2 C363.2 C503.2 R323.2 R363.2 R506.2 U303.4(V-) U313.4(GND) ; also sheet 3,5
BASE1: C343.+ D333.C Q303.1(B) Q313.C
BASE3: C344.+ D334.C Q304.1(B) Q314.C
D3V3 [power]: C314.+ C324.+ C364.1 Q304.3(E) R354.1 R510.2 U304.7(V+) U314.2(IN) ; also sheet 5,6
D7VU [power]: C354.1 D304.A Q304.2(C) R334.1 U504.3(IN) ; also sheet 3,5,6
DGND [power]: C324.- C334.- C354.2 C364.2 C504.2 R324.2 R364.2 R509.2 U304.4(V-) U314.4(GND) ; also sheet 1,2,3,5,6
N$39: C313.- D313.C D323.A R353.2 R363.1 U303.2(IN-)
N$40: R373.2 U313.6(OUT)
N$41: C333.+ D313.A D323.C R373.1 U303.3(IN+)
N$42: R343.2 U303.6(OUT)
N$43: D303.C Q313.B R323.1
N$44: Q313.E R333.2
N$45: C343.- D333.A R343.1
N$47: C314.- D314.C D324.A R354.2 R364.1 U304.2(IN-)
N$48: R374.2 U314.6(OUT)
N$59: C504.1 R508.2 R509.1 U504.1(ADJ)
N$63: C334.+ D314.A D324.C R374.1 U304.3(IN+)
N$64: R344.2 U304.6(OUT)
N$65: D304.C Q314.B R324.1
N$66: Q314.E R334.2
N$67: C344.- D334.A R344.1
N$72: R508.1 R510.1 U504.2(OUT)
N$73: C503.1 R505.2 R506.1 U503.1(ADJ)
N$74: R505.1 R507.1 U503.2(OUT)
Unconnected: U303.1(NC) U303.5(NC) U303.8(NC) U304.1(NC) U304.5(NC) U304.8(NC) U313.3(NR) U313.5(TRIM) U314.3(NR) U314.5(TRIM)

### Notes on the sheet
- Power Supply Inputs and Regulation (2/2)
- Use for LM317 only option | Use for LM317 only option
- +3.3V reg.
- +5V reg.

## Sheet 5 of 6
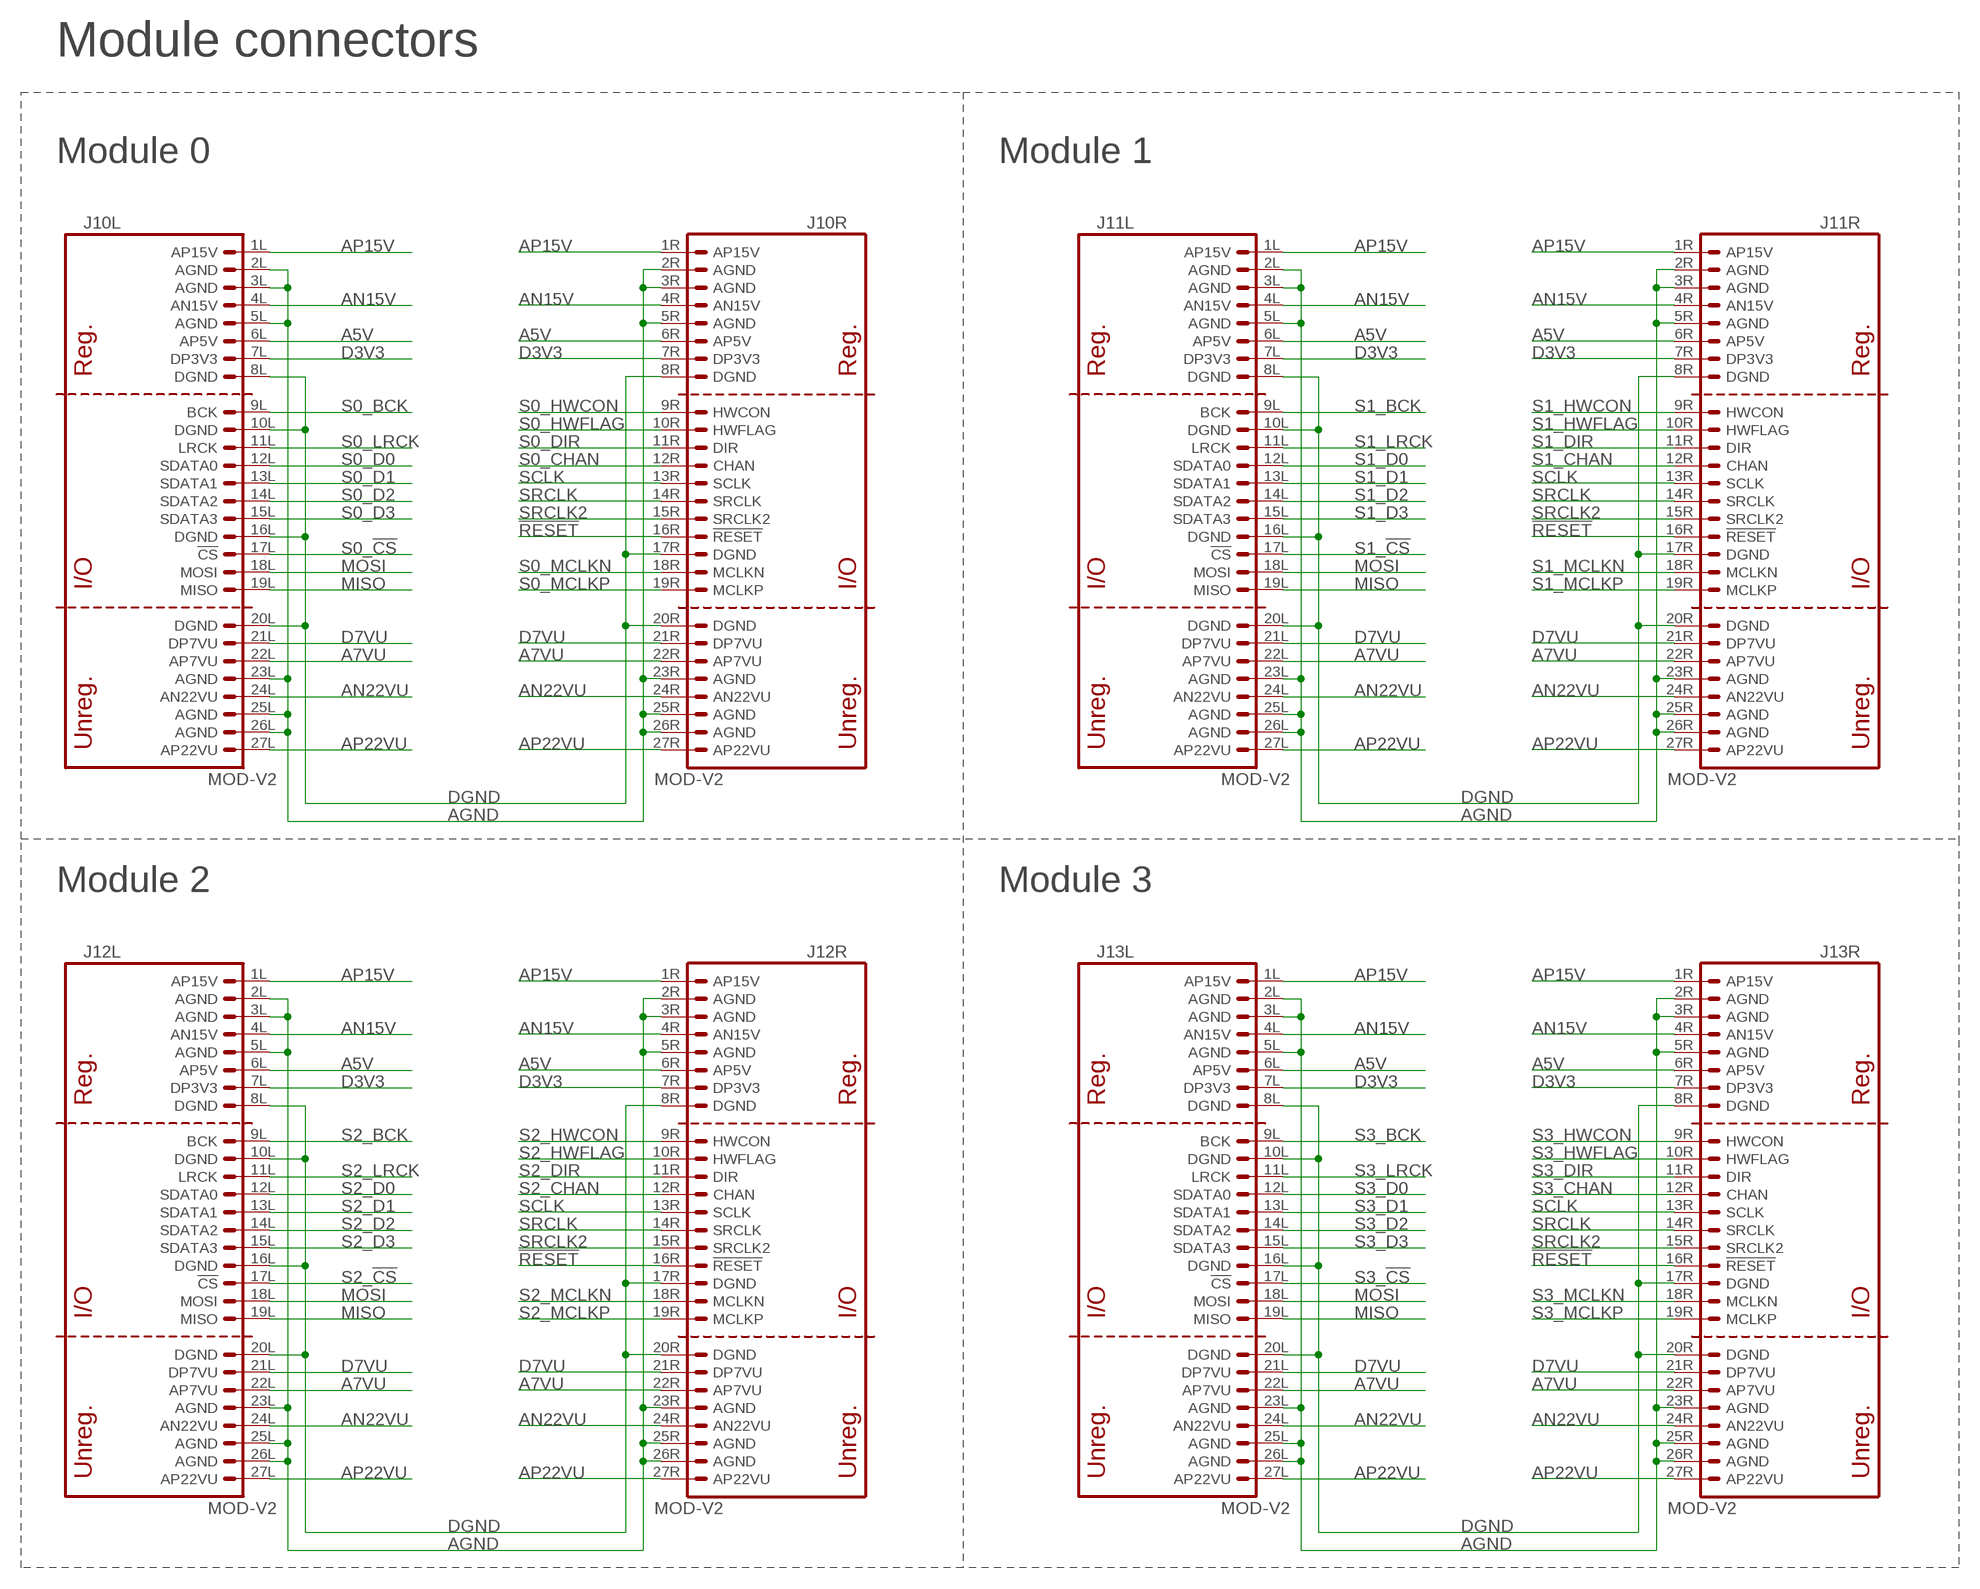
[diagram p5: schematic, sheet 5]

### Parts
J10  MOD-V2  [MOD-V2]
J11  MOD-V2  [MOD-V2]
J12  MOD-V2  [MOD-V2]
J13  MOD-V2  [MOD-V2]

### Nets
!RESET: J10.16R(R:!RESET) J11.16R(R:!RESET) J12.16R(R:!RESET) J13.16R(R:!RESET) ; also sheet 1
A5V: J10.6L(L:AP5V) J10.6R(R:AP5V) J11.6L(L:AP5V) J11.6R(R:AP5V) J12.6L(L:AP5V) J12.6R(R:AP5V) J13.6L(L:AP5V) J13.6R(R:AP5V) ; also sheet 4
A7VU [power]: J10.22L(L:AP7VU) J10.22R(R:AP7VU) J11.22L(L:AP7VU) J11.22R(R:AP7VU) J12.22L(L:AP7VU) J12.22R(R:AP7VU) J13.22L(L:AP7VU) J13.22R(R:AP7VU) ; also sheet 3,4
AGND [power]: J10.2L(L:AGND) J10.2R(R:AGND) J10.3L(L:AGND) J10.3R(R:AGND) J10.5L(L:AGND) J10.5R(R:AGND) J10.23L(L:AGND) J10.23R(R:AGND) J10.25L(L:AGND) J10.25R(R:AGND) J10.26L(L:AGND) J10.26R(R:AGND) J11.2L(L:AGND) J11.2R(R:AGND) J11.3L(L:AGND) J11.3R(R:AGND) J11.5L(L:AGND) J11.5R(R:AGND) J11.23L(L:AGND) J11.23R(R:AGND) J11.25L(L:AGND) J11.25R(R:AGND) J11.26L(L:AGND) J11.26R(R:AGND) J12.2L(L:AGND) J12.2R(R:AGND) J12.3L(L:AGND) J12.3R(R:AGND) J12.5L(L:AGND) J12.5R(R:AGND) J12.23L(L:AGND) J12.23R(R:AGND) J12.25L(L:AGND) J12.25R(R:AGND) J12.26L(L:AGND) J12.26R(R:AGND) J13.2L(L:AGND) J13.2R(R:AGND) J13.3L(L:AGND) J13.3R(R:AGND) J13.5L(L:AGND) J13.5R(R:AGND) J13.23L(L:AGND) J13.23R(R:AGND) J13.25L(L:AGND) J13.25R(R:AGND) J13.26L(L:AGND) J13.26R(R:AGND) ; also sheet 3,4
AN15V: J10.4L(L:AN15V) J10.4R(R:AN15V) J11.4L(L:AN15V) J11.4R(R:AN15V) J12.4L(L:AN15V) J12.4R(R:AN15V) J13.4L(L:AN15V) J13.4R(R:AN15V) ; also sheet 3
AN22VU [power]: J10.24L(L:AN22VU) J10.24R(R:AN22VU) J11.24L(L:AN22VU) J11.24R(R:AN22VU) J12.24L(L:AN22VU) J12.24R(R:AN22VU) J13.24L(L:AN22VU) J13.24R(R:AN22VU) ; also sheet 3
AP15V: J10.1L(L:AP15V) J10.1R(R:AP15V) J11.1L(L:AP15V) J11.1R(R:AP15V) J12.1L(L:AP15V) J12.1R(R:AP15V) J13.1L(L:AP15V) J13.1R(R:AP15V) ; also sheet 3
AP22VU [power]: J10.27L(L:AP22VU) J10.27R(R:AP22VU) J11.27L(L:AP22VU) J11.27R(R:AP22VU) J12.27L(L:AP22VU) J12.27R(R:AP22VU) J13.27L(L:AP22VU) J13.27R(R:AP22VU) ; also sheet 3
D3V3 [power]: J10.7L(L:DP3V3) J10.7R(R:DP3V3) J11.7L(L:DP3V3) J11.7R(R:DP3V3) J12.7L(L:DP3V3) J12.7R(R:DP3V3) J13.7L(L:DP3V3) J13.7R(R:DP3V3) ; also sheet 4,6
D7VU [power]: J10.21L(L:DP7VU) J10.21R(R:DP7VU) J11.21L(L:DP7VU) J11.21R(R:DP7VU) J12.21L(L:DP7VU) J12.21R(R:DP7VU) J13.21L(L:DP7VU) J13.21R(R:DP7VU) ; also sheet 3,4,6
DGND [power]: J10.8L(L:DGND) J10.8R(R:DGND) J10.10L(L:DGND) J10.16L(L:DGND) J10.17R(R:DGND) J10.20L(L:DGND) J10.20R(R:DGND) J11.8L(L:DGND) J11.8R(R:DGND) J11.10L(L:DGND) J11.16L(L:DGND) J11.17R(R:DGND) J11.20L(L:DGND) J11.20R(R:DGND) J12.8L(L:DGND) J12.8R(R:DGND) J12.10L(L:DGND) J12.16L(L:DGND) J12.17R(R:DGND) J12.20L(L:DGND) J12.20R(R:DGND) J13.8L(L:DGND) J13.8R(R:DGND) J13.10L(L:DGND) J13.16L(L:DGND) J13.17R(R:DGND) J13.20L(L:DGND) J13.20R(R:DGND) ; also sheet 1,2,3,4,6
MISO: J10.19L(L:MISO) J11.19L(L:MISO) J12.19L(L:MISO) J13.19L(L:MISO) ; also sheet 1,6
MOSI: J10.18L(L:MOSI) J11.18L(L:MOSI) J12.18L(L:MOSI) J13.18L(L:MOSI) ; also sheet 1
S0_!CS: J10.17L(L:!CS) ; also sheet 6
S0_BCK: J10.9L(L:BCK) ; also sheet 2
S0_CHAN: J10.12R(R:CHAN) ; also sheet 6
S0_D0: J10.12L(L:SDATA0) ; also sheet 2
S0_D1: J10.13L(L:SDATA1) ; also sheet 2
S0_D2: J10.14L(L:SDATA2) ; also sheet 2
S0_D3: J10.15L(L:SDATA3) ; also sheet 2
S0_DIR: J10.11R(R:DIR) ; also sheet 2,6
S0_HWCON: J10.9R(R:HWCON) ; also sheet 6
S0_HWFLAG: J10.10R(R:HWFLAG) ; also sheet 6
S0_LRCK: J10.11L(L:LRCK) ; also sheet 2
S0_MCLKN: J10.18R(R:MCLKN) ; also sheet 6
S0_MCLKP: J10.19R(R:MCLKP) ; also sheet 6
S1_!CS: J11.17L(L:!CS) ; also sheet 6
S1_BCK: J11.9L(L:BCK) ; also sheet 2
S1_CHAN: J11.12R(R:CHAN) ; also sheet 6
S1_D0: J11.12L(L:SDATA0) ; also sheet 2
S1_D1: J11.13L(L:SDATA1) ; also sheet 2
S1_D2: J11.14L(L:SDATA2) ; also sheet 2
S1_D3: J11.15L(L:SDATA3) ; also sheet 2
S1_DIR: J11.11R(R:DIR) ; also sheet 2,6
S1_HWCON: J11.9R(R:HWCON) ; also sheet 6
S1_HWFLAG: J11.10R(R:HWFLAG) ; also sheet 6
S1_LRCK: J11.11L(L:LRCK) ; also sheet 2
S1_MCLKN: J11.18R(R:MCLKN) ; also sheet 6
S1_MCLKP: J11.19R(R:MCLKP) ; also sheet 6
S2_!CS: J12.17L(L:!CS) ; also sheet 6
S2_BCK: J12.9L(L:BCK) ; also sheet 2
S2_CHAN: J12.12R(R:CHAN) ; also sheet 6
S2_D0: J12.12L(L:SDATA0) ; also sheet 2
S2_D1: J12.13L(L:SDATA1) ; also sheet 2
S2_D2: J12.14L(L:SDATA2) ; also sheet 2
S2_D3: J12.15L(L:SDATA3) ; also sheet 2
S2_DIR: J12.11R(R:DIR) ; also sheet 2,6
S2_HWCON: J12.9R(R:HWCON) ; also sheet 6
S2_HWFLAG: J12.10R(R:HWFLAG) ; also sheet 6
S2_LRCK: J12.11L(L:LRCK) ; also sheet 2
S2_MCLKN: J12.18R(R:MCLKN) ; also sheet 6
S2_MCLKP: J12.19R(R:MCLKP) ; also sheet 6
S3_!CS: J13.17L(L:!CS) ; also sheet 6
S3_BCK: J13.9L(L:BCK) ; also sheet 2
S3_CHAN: J13.12R(R:CHAN) ; also sheet 6
S3_D0: J13.12L(L:SDATA0) ; also sheet 2
S3_D1: J13.13L(L:SDATA1) ; also sheet 2
S3_D2: J13.14L(L:SDATA2) ; also sheet 2
S3_D3: J13.15L(L:SDATA3) ; also sheet 2
S3_DIR: J13.11R(R:DIR) ; also sheet 2,6
S3_HWCON: J13.9R(R:HWCON) ; also sheet 6
S3_HWFLAG: J13.10R(R:HWFLAG) ; also sheet 6
S3_LRCK: J13.11L(L:LRCK) ; also sheet 2
S3_MCLKN: J13.18R(R:MCLKN) ; also sheet 6
S3_MCLKP: J13.19R(R:MCLKP) ; also sheet 6
SCLK: J10.13R(R:SCLK) J11.13R(R:SCLK) J12.13R(R:SCLK) J13.13R(R:SCLK) ; also sheet 1,6
SRCLK: J10.14R(R:SRCLK) J11.14R(R:SRCLK) J12.14R(R:SRCLK) J13.14R(R:SRCLK) ; also sheet 1,6
SRCLK2: J10.15R(R:SRCLK2) J11.15R(R:SRCLK2) J12.15R(R:SRCLK2) J13.15R(R:SRCLK2) ; also sheet 1

### Notes on the sheet
- Module connectors
- Module 0 | Module 1
- Module 2 | Module 3

## Sheet 6 of 6
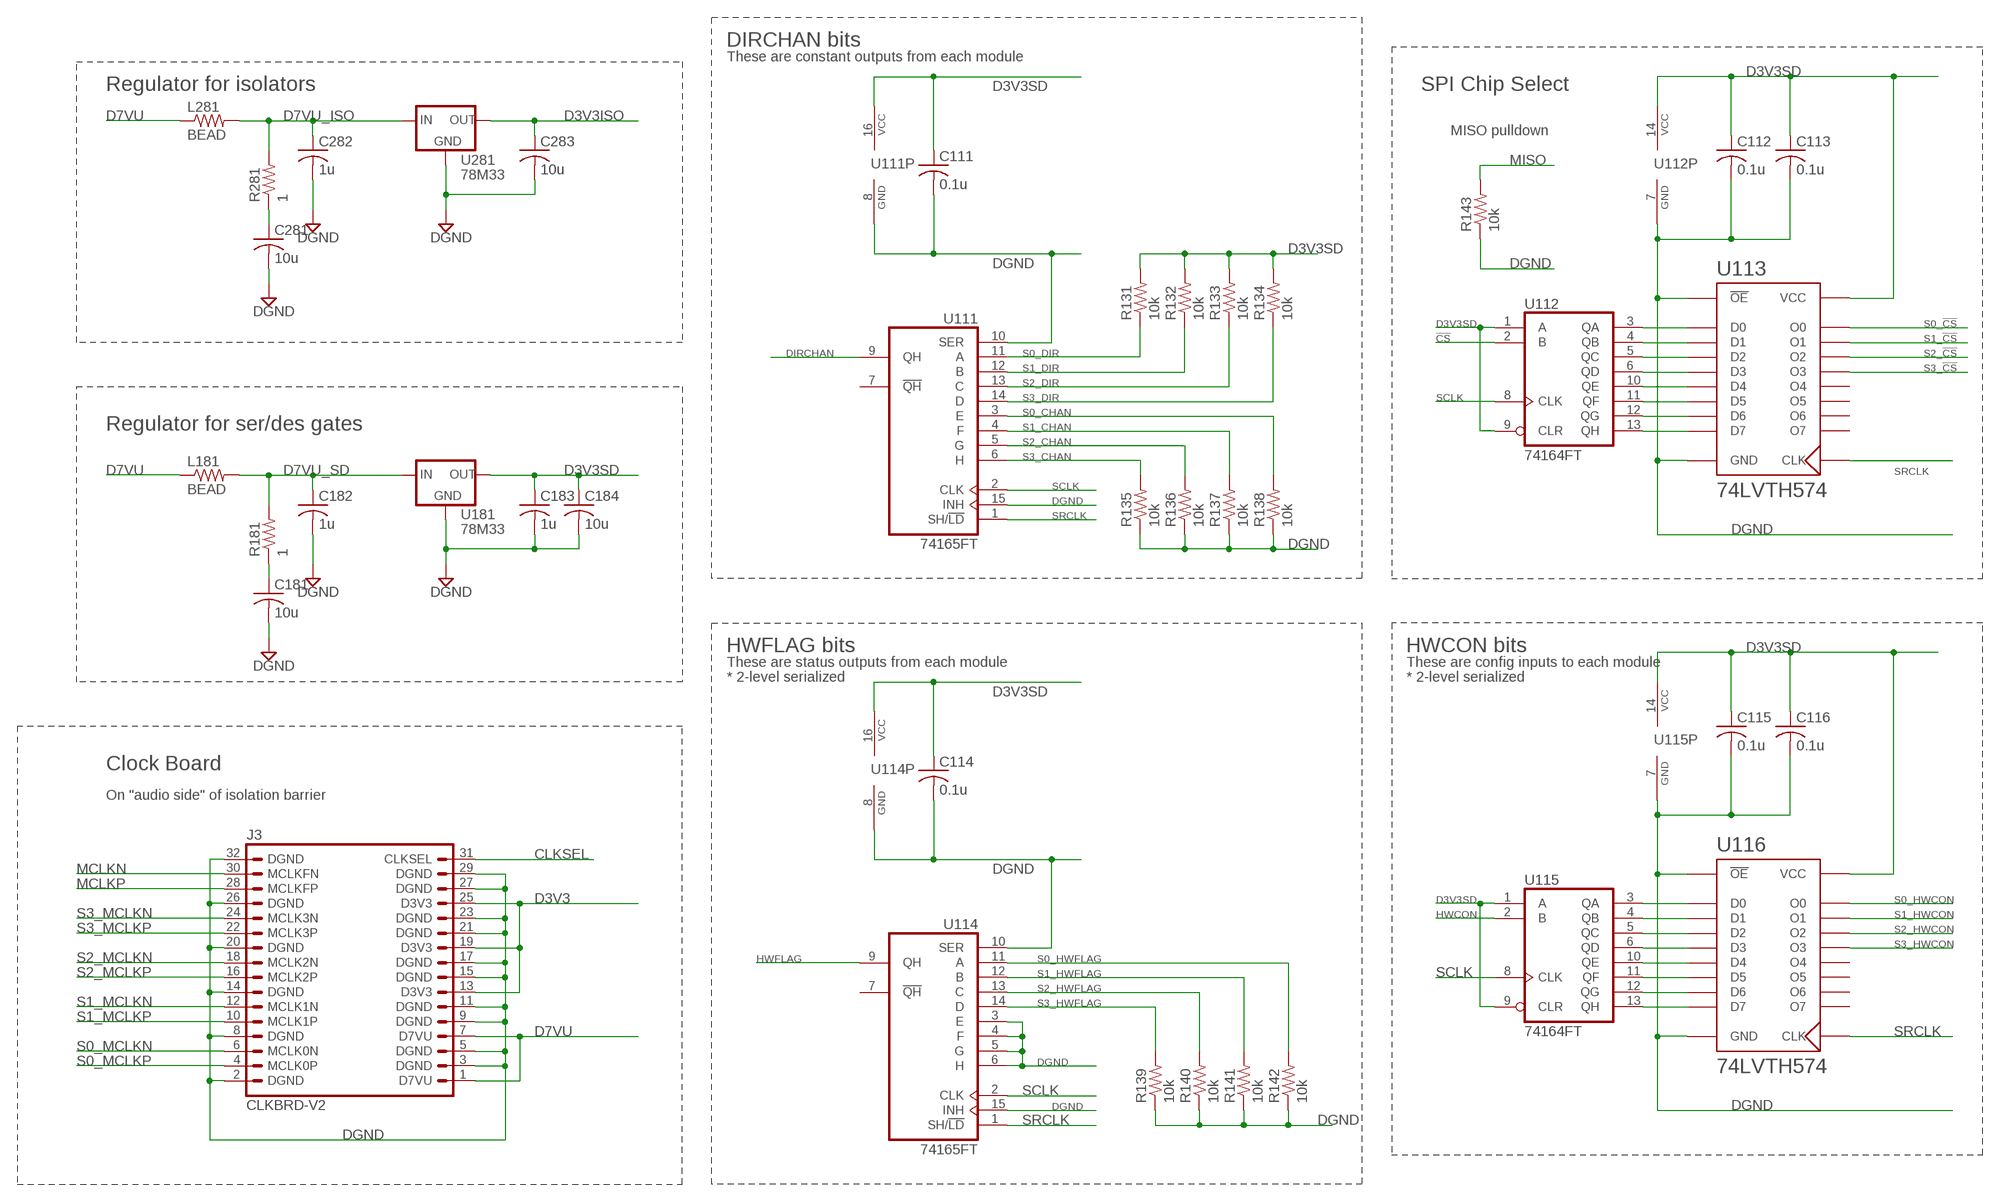
[diagram p6: schematic, sheet 6]

### Parts
C111  0.1u  C-USC0603  [C0603]
C112  0.1u  C-USC0603  [C0603]
C113  0.1u  C-USC0603  [C0603]
C114  0.1u  C-USC0603  [C0603]
C115  0.1u  C-USC0603  [C0603]
C116  0.1u  C-USC0603  [C0603]
C181  10u  C-USC1206  [C1206]
C182  1u  C-USC1206  [C1206]
C183  1u  C-USC1206  [C1206]
C184  10u  C-USC1206  [C1206]
C281  10u  C-USC1206  [C1206]
C282  1u  C-USC1206  [C1206]
C283  10u  C-USC1206  [C1206]
J3  CLKBRD-V2  [MA16-2]
L181  BEAD  R-US_R1206  [R1206]
L281  BEAD  R-US_R1206  [R1206]
R131  10k  R-US_R0603  [R0603]
R132  10k  R-US_R0603  [R0603]
R133  10k  R-US_R0603  [R0603]
R134  10k  R-US_R0603  [R0603]
R135  10k  R-US_R0603  [R0603]
R136  10k  R-US_R0603  [R0603]
R137  10k  R-US_R0603  [R0603]
R138  10k  R-US_R0603  [R0603]
R139  10k  R-US_R0603  [R0603]
R140  10k  R-US_R0603  [R0603]
R141  10k  R-US_R0603  [R0603]
R142  10k  R-US_R0603  [R0603]
R143  10k  R-US_R0603  [R0603]
R181  1  R-US_R1206  [R1206]
R281  1  R-US_R1206  [R1206]
U111  74165FT  [TSSOP16]
U112  74164FT  [TSSOP14]
U113  74LVTH574  [TSSOP20]
U114  74165FT  [TSSOP16]
U115  74164FT  [TSSOP14]
U116  74LVTH574  [TSSOP20]
U181  78M33  78XXS  [DPACK]
U281  78M33  78XXS  [DPACK]

### Nets
!CS: U112.2(B) ; also sheet 1
CLKSEL: J3.31(CLKSEL) ; also sheet 1
D3V3 [power]: J3.13(D3V3) J3.19(D3V3) J3.25(D3V3) ; also sheet 4,5
D3V3ISO [power]: C283.1 U281.3(OUT) ; also sheet 1,2
D3V3SD [power]: C111.1 C112.1 C113.1 C114.1 C115.1 C116.1 C183.1 C184.1 R131.2 R132.2 R133.2 R134.2 U111.16(VCC) U112.1(A) U112.9(CLR) U112.14(VCC) U113.20(VCC) U114.16(VCC) U115.1(A) U115.9(CLR) U115.14(VCC) U116.20(VCC) U181.3(OUT)
D7VU [power]: J3.1(D7VU) J3.7(D7VU) L181.1 L281.1 ; also sheet 3,4,5
D7VU_ISO: C282.1 L281.2 R281.2 U281.1(IN)
D7VU_SD: C182.1 L181.2 R181.2 U181.1(IN)
DGND [power]: C111.2 C112.2 C113.2 C114.2 C115.2 C116.2 C181.2 C182.2 C183.2 C184.2 C281.2 C282.2 C283.2 J3.2(DGND) J3.3(DGND) J3.5(DGND) J3.8(DGND) J3.9(DGND) J3.11(DGND) J3.14(DGND) J3.15(DGND) J3.17(DGND) J3.20(DGND) J3.21(DGND) J3.23(DGND) J3.26(DGND) J3.27(DGND) J3.29(DGND) J3.32(DGND) R135.1 R136.1 R137.1 R138.1 R139.1 R140.1 R141.1 R142.1 R143.1 U111.8(GND) U111.10(SER) U111.15(INH) U112.7(GND) U113.1(!OE) U113.10(GND) U114.3(E) U114.4(F) U114.5(G) U114.6(H) U114.8(GND) U114.10(SER) U114.15(INH) U115.7(GND) U116.1(!OE) U116.10(GND) U181.4(GND) U281.4(GND) ; also sheet 1,2,3,4,5
DIRCHAN: U111.9(QH) ; also sheet 1
HWCON: U115.2(B) ; also sheet 1
HWFLAG: U114.9(QH) ; also sheet 1
MCLKN: J3.30(MCLKFN) ; also sheet 1
MCLKP: J3.28(MCLKFP) ; also sheet 1
MISO: R143.2 ; also sheet 1,5
N$3: U112.3(QA) U113.2(D0)
N$4: U112.4(QB) U113.3(D1)
N$5: U112.5(QC) U113.4(D2)
N$6: U112.6(QD) U113.5(D3)
N$7: U112.10(QE) U113.6(D4)
N$8: U112.11(QF) U113.7(D5)
N$9: U112.12(QG) U113.8(D6)
N$10: U112.13(QH) U113.9(D7)
N$12: U115.3(QA) U116.2(D0)
N$13: U115.4(QB) U116.3(D1)
N$14: U115.5(QC) U116.4(D2)
N$15: U115.6(QD) U116.5(D3)
N$16: U115.10(QE) U116.6(D4)
N$17: U115.11(QF) U116.7(D5)
N$18: U115.12(QG) U116.8(D6)
N$19: C181.1 R181.1
N$20: U115.13(QH) U116.9(D7)
N$29: C281.1 R281.1
S0_!CS: U113.19(O0) ; also sheet 5
S0_CHAN: R138.2 U111.3(E) ; also sheet 5
S0_DIR: R131.1 U111.11(A) ; also sheet 2,5
S0_HWCON: U116.19(O0) ; also sheet 5
S0_HWFLAG: R142.2 U114.11(A) ; also sheet 5
S0_MCLKN: J3.6(MCLK0N) ; also sheet 5
S0_MCLKP: J3.4(MCLK0P) ; also sheet 5
S1_!CS: U113.18(O1) ; also sheet 5
S1_CHAN: R137.2 U111.4(F) ; also sheet 5
S1_DIR: R132.1 U111.12(B) ; also sheet 2,5
S1_HWCON: U116.18(O1) ; also sheet 5
S1_HWFLAG: R141.2 U114.12(B) ; also sheet 5
S1_MCLKN: J3.12(MCLK1N) ; also sheet 5
S1_MCLKP: J3.10(MCLK1P) ; also sheet 5
S2_!CS: U113.17(O2) ; also sheet 5
S2_CHAN: R136.2 U111.5(G) ; also sheet 5
S2_DIR: R133.1 U111.13(C) ; also sheet 2,5
S2_HWCON: U116.17(O2) ; also sheet 5
S2_HWFLAG: R140.2 U114.13(C) ; also sheet 5
S2_MCLKN: J3.18(MCLK2N) ; also sheet 5
S2_MCLKP: J3.16(MCLK2P) ; also sheet 5
S3_!CS: U113.16(O3) ; also sheet 5
S3_CHAN: R135.2 U111.6(H) ; also sheet 5
S3_DIR: R134.1 U111.14(D) ; also sheet 2,5
S3_HWCON: U116.16(O3) ; also sheet 5
S3_HWFLAG: R139.2 U114.14(D) ; also sheet 5
S3_MCLKN: J3.24(MCLK3N) ; also sheet 5
S3_MCLKP: J3.22(MCLK3P) ; also sheet 5
SCLK: U111.2(CLK) U112.8(CLK) U114.2(CLK) U115.8(CLK) ; also sheet 1,5
SRCLK: U111.1(SH/!LD) U113.11(CLK) U114.1(SH/!LD) U116.11(CLK) ; also sheet 1,5
Unconnected: U111.7(!QH) U113.12(O7) U113.13(O6) U113.14(O5) U113.15(O4) U114.7(!QH) U116.12(O7) U116.13(O6) U116.14(O5) U116.15(O4)

### Notes on the sheet
- DIRCHAN bits
- These are constant outputs from each module
- Regulator for isolators | SPI Chip Select
- MISO pulldown
- Regulator for ser/des gates
- HWFLAG bits | HWCON bits
- These are status outputs from each module | These are config inputs to each module
- * 2-level serialized | * 2-level serialized
- Clock Board
- On "audio side" of isolation barrier

## Library data of the parts
C111-C116 C121-C123 C181-C184 C201-C206 C211-C216 C221-C226 C231-C236 C240 C261-C266 C271 C272 C281-C283 C351-C354 C361-C364 C371 C501-C504 = rcl:C-US: CAPACITOR, American symbol
C301 C302 C311-C314 C321-C324 C331-C334 C341-C344 = rcl:CPOL-US: POLARIZED CAPACITOR, American symbol
D301-D304 = led:LED: LED OSRAM: - CHIPLED LG R971, LG N971, LY N971, LG Q971, LY Q971, LO R971, LY R971 LH N974, LH R974 LS Q976, LO Q976, LY Q976 LO Q996 - Hyper CHIPLED LW Q18S LB Q993, LB Q99A, LB R99A - SideLED LS A670, LO A670, LY A670, LG A670, LP A670 LB A673, LV A673, LT A673, LW A673 LH A674 LY A675 LS A676, LA A676, LO A676, LY A676, LW A676 LS A679, LY A679, LG A679 - Hyper Micro SIDELED® LS Y876, LA Y876, LO Y876, LY Y876 LT Y87S - SmartLED LW L88C, LW L88S LB L89C, LB L89S, LG L890 LS L89K, LO L89K, LY L89K LS L896, LA L896, LO L896, LY L896 - TOPLED LS T670, LO T670, LY T670, LG T670, LP T670 LSG T670, LSP T670, LSY T670, LOP T670, LYG T670 LG T671, LOG T671, LSG T671 LB T673, LV T673, LT T673, LW T673 LH T674 LS T676, LA T676, LO T676, LY T676, LB T676, LH T676, LSB T676, LW T676 LB T67C, LV T67C, LT T67C, LS T67K, LO T67K, LY T67K, LW E67C LS E67B, LA E67B, LO E67B, LY E67B, LB E67C, LV E67C, LT E67C LW T67C LS T679, LY T679, LG T679 LS T770, LO T770, LY T770, LG T770, LP T770 LB T773, LV T773, LT T773, LW T773 LH T774 LS E675, LA E675, LY E675, LS T675 LS T776, LA T776, LO T776, LY T776, LB T776 LHGB T686 LT T68C, LB T68C - Hyper Mini TOPLED® LB M676 - Mini TOPLED Santana® LG M470 LS M47K, LO M47K, LY M47K Source: http://www.osram.convergy.de LUXEON: - LUMILED® LXK2-PW12-R00, LXK2-PW12-S00, LXK2-PW14-U00, LXK2-PW14-V00 LXK2-PM12-R00, LXK2-PM12-S00, LXK2-PM14-U00 LXK2-PE12-Q00, LXK2-PE12-R00, LXK2-PE12-S00, LXK2-PE14-T00, LXK2-PE14-U00 LXK2-PB12-K00, LXK2-PB12-L00, LXK2-PB12-M00, LXK2-PB14-N00, LXK2-PB14-P00, LXK2-PB14-Q00 LXK2-PR12-L00, LXK2-PR12-M00, LXK2-PR14-Q00, LXK2-PR14-R00 LXK2-PD12-Q00, LXK2-PD12-R00, LXK2-PD12-S00 LXK2-PH12-R00, LXK2-PH12-S00 LXK2-PL12-P00, LXK2-PL12-Q00, LXK2-PL12-R00 Source: www.luxeon.com KINGBRIGHT: KA-3528ASYC Source: www.kingbright.com
D311-D314 D321-D324 = smps:1N4148_SMD: Tiny version 1N4148 switching diode 75V, 150mA, SOD-123 package Digikey part number 1N4148WDICT-ND
D331-D334 = cdp:ZD
J1 = cdp:CARRIER-V2
J2 = cdp:PSU-V2
J3 = cdp:CLKBRD-V2
J4 = cdp:MA24-2
J10-J13 = cdp:MOD-V2
L101 L181 L281 L401 R121-R124 R131-R143 R181 R281 R301 R302 R311 R312 R321-R324 R331-R334 R341-R344 R351-R354 R361-R364 R371-R374 R382 R401-R436 R501-R510 = rcl:R-US_: RESISTOR, American symbol
Q301 Q303 Q304 = cdp:D44H11
Q302 = cdp:D45H11
Q311 Q313 Q314 = transistor-pnp:BC807*: PNP Transistror
Q312 = transistor-npn:BC817*: NPN Transistor
U111 U114 = cdp:74*165: 8-bit parallel load SHIFT REGISTER
U112 U115 U271 = cdp:74*164: 8-bit parallel out SHIFT REGISTER
U113 U116 U272 = cdp:74LVTH574
U121 = cdp:DS90LV012
U181 U281 = cdp:78XXS: VOLTAGE REGULATOR
U201-U203 U211-U213 U221-U223 U231-U233 U262 = cdp:ADUM3402
U240 = cdp:74*04: Hex INVERTER
U261 U263 = cdp:ADUM3401
U301-U304 = analog-devices:AD811_SO8: ANALOG DEVICES; MF: ALTERA CORPORATION; MPN: AD811JRZ; OC_FARNELL: unknown; OC_NEWARK: 82H2980
U311 U313 U314 = cdp:MAX6220
U312 = linear-technology:LT1236?*: Precision Voltage Reference Source: http://www.linear.com/pc/downloadDocument.do?navId=H0,C1,C1154,C1002,C1243,P1156,D2948; OC_FARNELL: unknown; OC_NEWARK: unknown
U321 U503 U504 = v-reg:LM317?*: 500 mA Adjustable Output Positive Voltage Regulator Source: http://www.onsemi.co.jp .. LM317M-D.PDF
U322 = cdp:LM337L: VOLTAGE REGULATOR